# EAGLE schematic CFT-PB3-revB (EAGLE 5.11)
DRAWN_BY: Alexios; PROJECT_NAME: CFT Mini-Computer; REVISION: Rev B; SHEET_DESCRIPTION: 8 kW Bank Switching Memory Controller (with 74670); SIMULATION_FILENAME: memory.v#bank_switch; URL: http://www.bedroomlan.org/cft

## Sheet 1 of 7
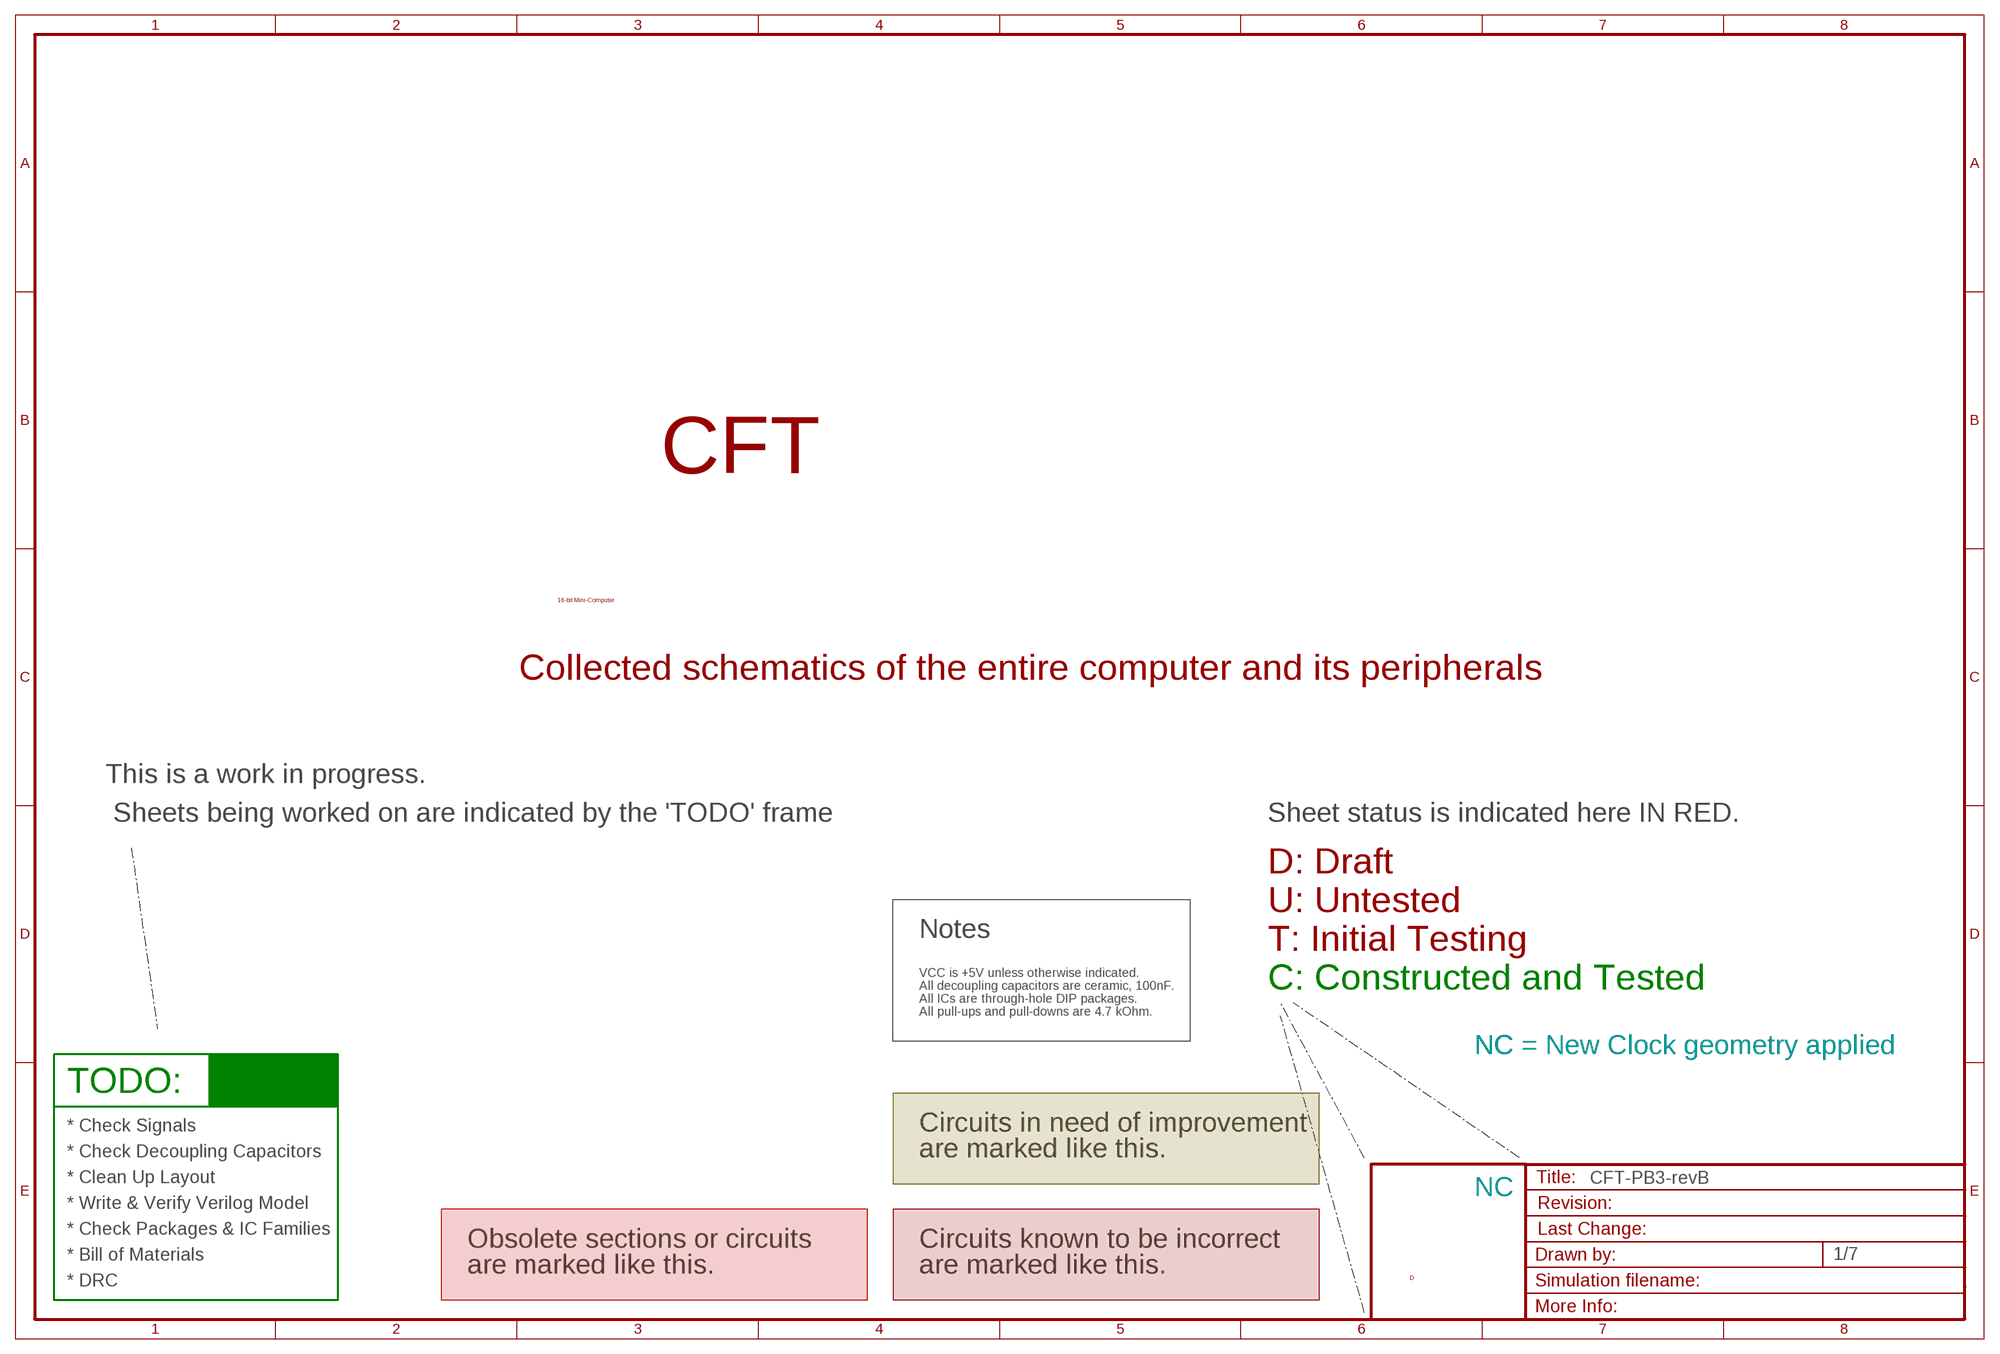
[diagram p0: schematic, sheet 1]

### Notes on the sheet
- CFT
- 16-bit Mini-Computer
- Collected schematics of the entire computer and its peripherals
- This is a work in progress.
- Sheets being worked on are indicated by the 'TODO' frame | Sheet status is indicated here IN RED.
- D: Draft
- U: Untested
- Notes
- T: Initial Testing
- VCC is +5V unless otherwise indicated.
- All decoupling capacitors are ceramic, 100nF. | C: Constructed and Tested
- All ICs are through-hole DIP packages.
- All pull-ups and pull-downs are 4.7 kOhm.
- NC | NC = New Clock geometry applied
- TODO:
- * Check Signals | Circuits in need of improvement
- * Check Decoupling Capacitors | are marked like this.
- * Clean Up Layout
- NC
- * Write & Verify Verilog Model
- * Check Packages & IC Families
- Obsolete sections or circuits | Circuits known to be incorrect
- * Bill of Materials
- are marked like this. | are marked like this.
- D
- * DRC

## Sheet 2 of 7
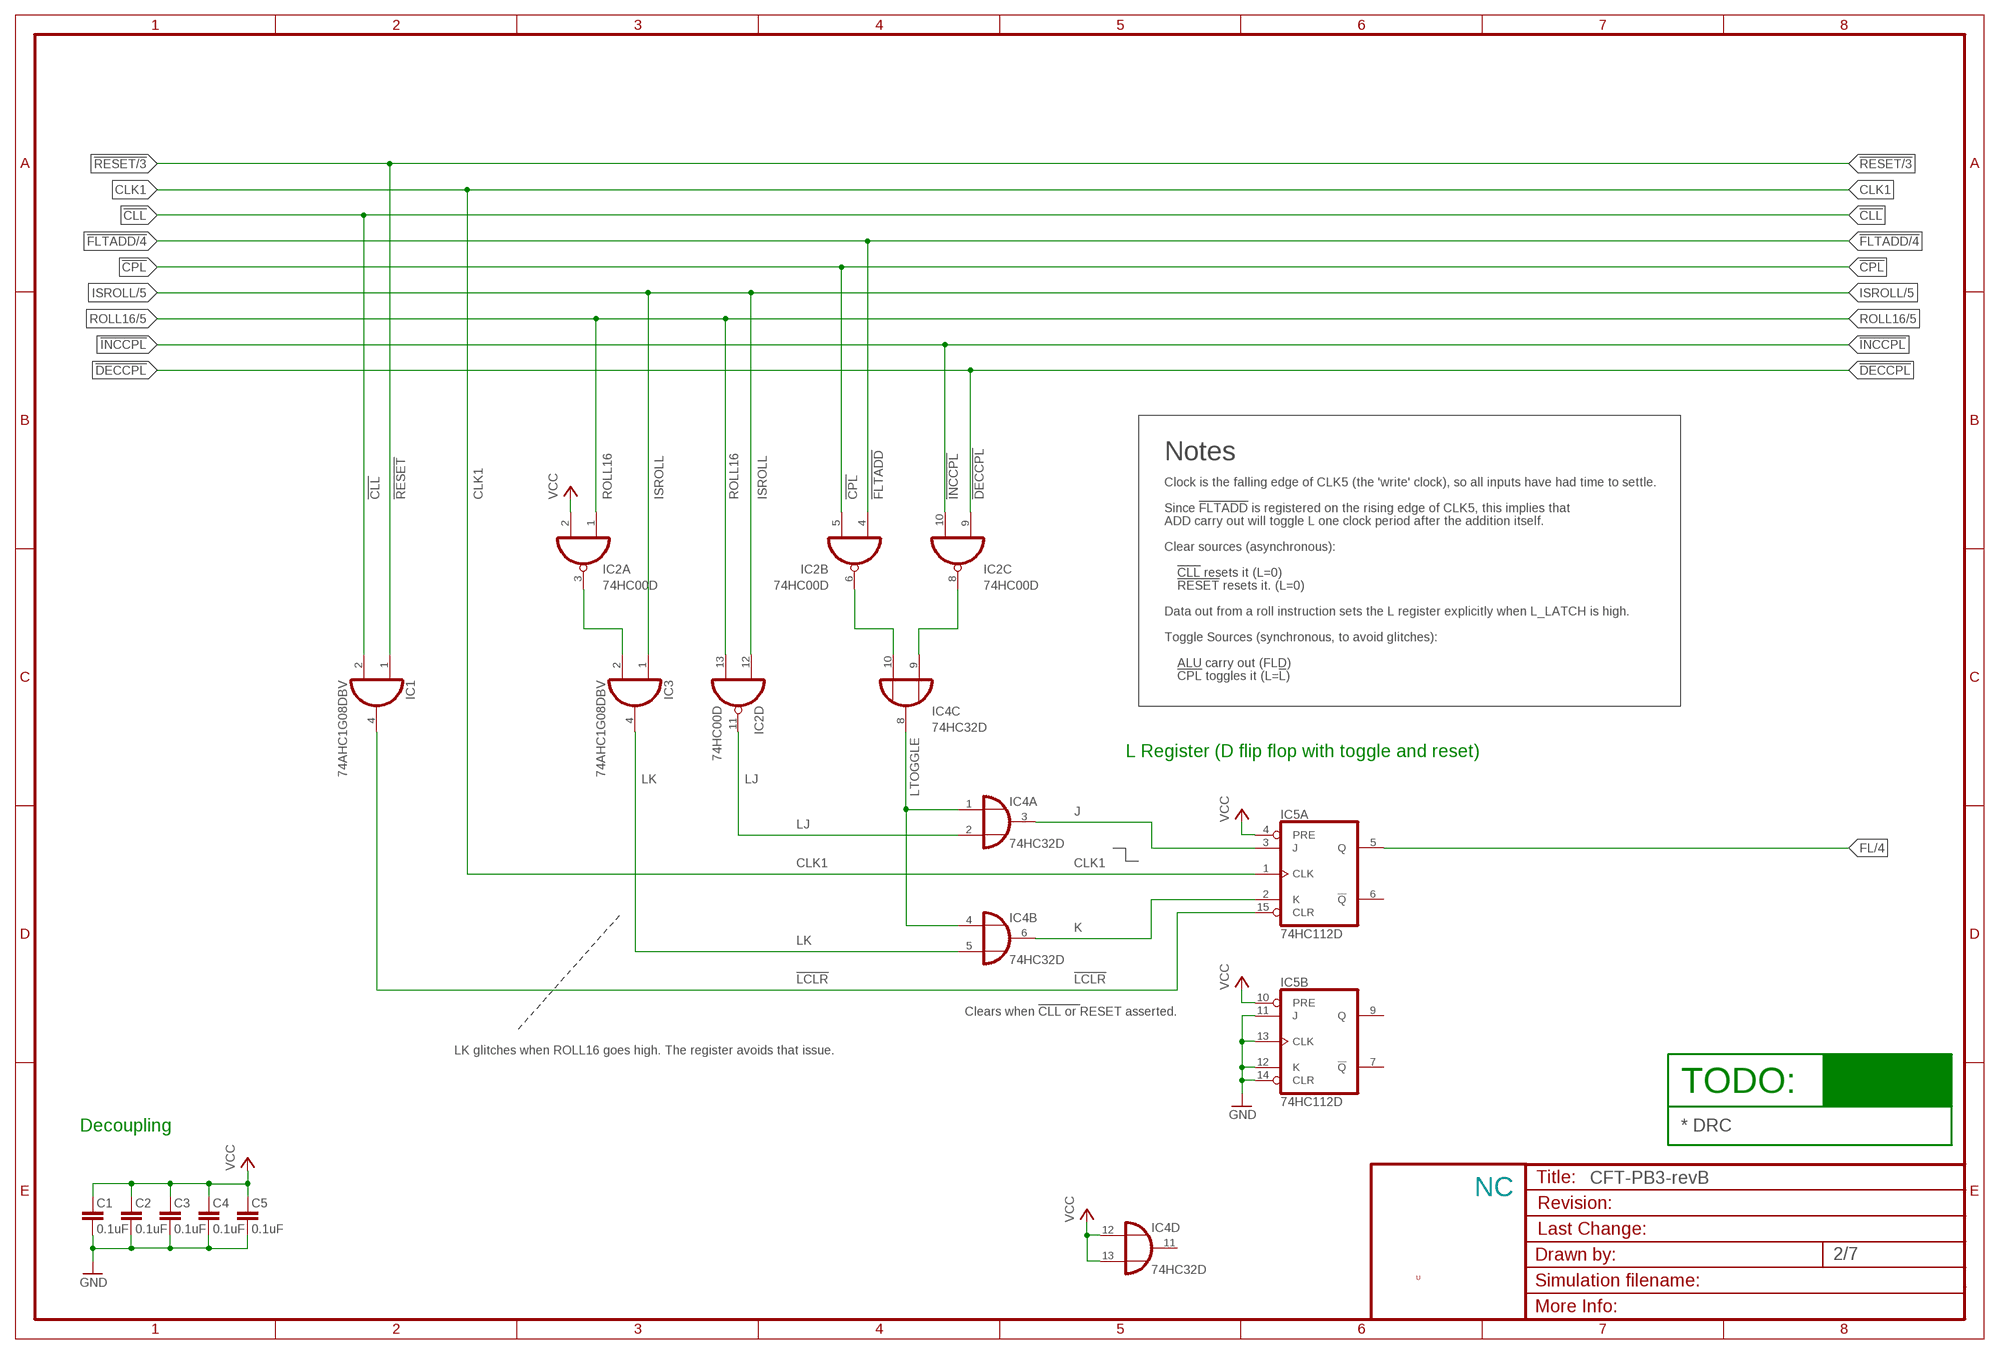
[diagram p1: schematic, sheet 2]

### Parts
C1  0.1uF  C-EUC0805K  [C0805K]
C2  0.1uF  C-EUC0805K  [C0805K]
C3  0.1uF  C-EUC0805K  [C0805K]
C4  0.1uF  C-EUC0805K  [C0805K]
C5  0.1uF  C-EUC0805K  [C0805K]
IC1  74AHC1G08DBV  [SOT23-5]
IC2  74HC00D  [SO14]
IC3  74AHC1G08DBV  [SOT23-5]
IC4  74HC32D  [SO14]
IC5  74HC112D  [SO16]

### Nets
!CLL: IC1.2(I1) ; also sheet 7
!CPL: IC2.5(B:I1) ; also sheet 7
!DECCPL: IC2.9(C:I0) ; also sheet 7
!FLTADD: IC2.4(B:I0) ; also sheet 4
!INCCPL: IC2.10(C:I1) ; also sheet 7
!LCLR: IC1.4(O) IC5.15(A:CLR)
!RESET: IC1.1(I0) ; also sheet 3,4,5,6,7
CLK1: IC5.1(A:CLK) ; also sheet 7
FL: IC5.5(A:Q) ; also sheet 4,5,7
GND [low power]: C1.1 C2.1 C3.1 C4.1 C5.1 IC5.11(B:J) IC5.12(B:K) IC5.13(B:CLK) IC5.14(B:CLR) ; also sheet 3,4,5,6,7
ISROLL: IC2.12(D:I0) IC3.1(I0) ; also sheet 5
J: IC4.3(A:O) IC5.3(A:J)
K: IC4.6(B:O) IC5.2(A:K)
LJ: IC2.11(D:O) IC4.2(A:I1)
LK: IC3.4(O) IC4.5(B:I1)
LTOGGLE: IC4.1(A:I0) IC4.4(B:I0) IC4.8(C:O)
LTOGGLE0: IC2.6(B:O) IC4.10(C:I1)
LTOGGLE1: IC2.8(C:O) IC4.9(C:I0)
N$98: IC2.3(A:O) IC3.2(I1)
ROLL16: IC2.1(A:I0) IC2.13(D:I1) ; also sheet 5
VCC [low power]: C1.2 C2.2 C3.2 C4.2 C5.2 IC2.2(A:I1) IC4.12(D:I0) IC4.13(D:I1) IC5.4(A:PRE) IC5.10(B:PRE) ; also sheet 3,4,5,6,7
Unconnected: IC4.11(D:O) IC5.6(A:!Q) IC5.7(B:!Q) IC5.9(B:Q)

### Notes on the sheet
- Notes
- Clock is the falling edge of CLK5 (the 'write' clock), so all inputs have had time to settle.
- Since !FLTADD! is registered on the rising edge of CLK5, this implies that
- ADD carry out will toggle L one clock period after the addition itself.
- Clear sources (asynchronous):
- !CLL! resets it (L=0)
- !RESET! resets it. (L=0)
- Data out from a roll instruction sets the L register explicitly when L_LATCH is high.
- Toggle Sources (synchronous, to avoid glitches):
- ALU carry out (FLD)
- !CPL! toggles it (L=!L!)
- L Register (D flip flop with toggle and reset)
- Clears when !CLL or !RESET asserted.
- LK glitches when ROLL16 goes high. The register avoids that issue.
- TODO:
- Decoupling | * DRC
- NC
- U

## Sheet 3 of 7
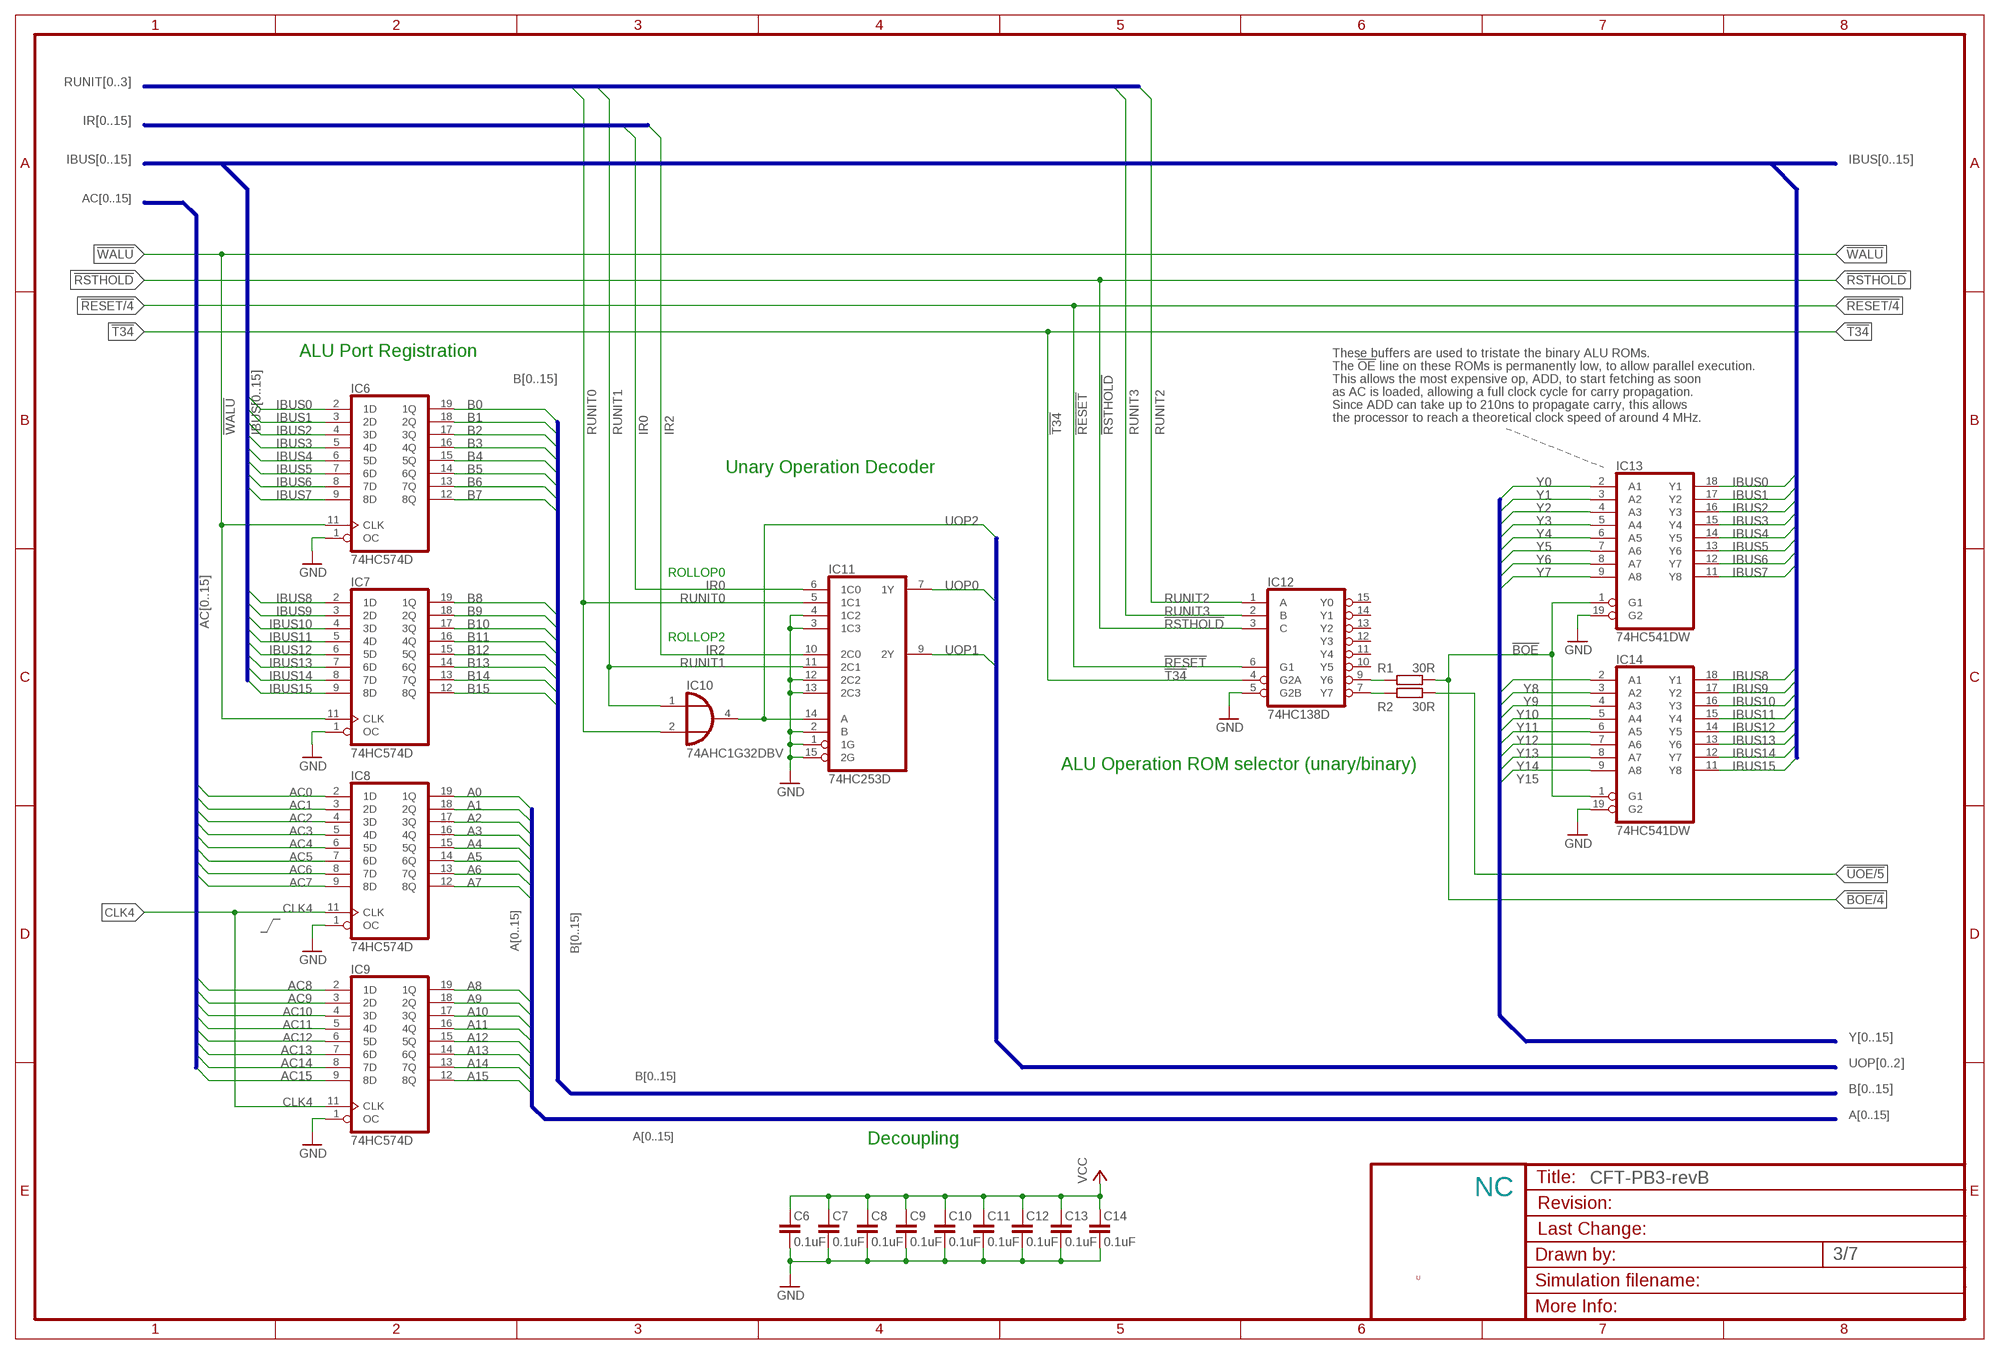
[diagram p2: schematic, sheet 3]

### Parts
C6  0.1uF  C-EUC0805K  [C0805K]
C7  0.1uF  C-EUC0805K  [C0805K]
C8  0.1uF  C-EUC0805K  [C0805K]
C9  0.1uF  C-EUC0805K  [C0805K]
C10  0.1uF  C-EUC0805K  [C0805K]
C11  0.1uF  C-EUC0805K  [C0805K]
C12  0.1uF  C-EUC0805K  [C0805K]
C13  0.1uF  C-EUC0805K  [C0805K]
C14  0.1uF  C-EUC0805K  [C0805K]
IC6  74HC574D  [SO20W]
IC7  74HC574D  [SO20W]
IC8  74HC574D  [SO20W]
IC9  74HC574D  [SO20W]
IC10  74AHC1G32DBV  [SOT23-5]
IC11  74HC253D  [SO16]
IC12  74HC138D  [SO16]
IC13  74HC541DW  [SO20W]
IC14  74HC541DW  [SO20W]
R1  30R  R-EU_R0805  [R0805]
R2  30R  R-EU_R0805  [R0805]

### Nets
!BOE: IC13.1(G1) IC14.1(G1) R1.2 ; also sheet 4
!RESET: IC12.6(G1) ; also sheet 2,4,5,6,7
!RSTHOLD: IC12.3(C) ; also sheet 7
!T34: IC12.4(G2A) ; also sheet 7
!UOE: R2.2 ; also sheet 5
!WALU: IC6.11(CLK) IC7.11(CLK) ; also sheet 7
A0: IC8.19(1Q) ; also sheet 4,5
A1: IC8.18(2Q) ; also sheet 4,5
A2: IC8.17(3Q) ; also sheet 4,5
A3: IC8.16(4Q) ; also sheet 4,5
A4: IC8.15(5Q) ; also sheet 4,5
A5: IC8.14(6Q) ; also sheet 4,5
A6: IC8.13(7Q) ; also sheet 4,5
A7: IC8.12(8Q) ; also sheet 4,5
A8: IC9.19(1Q) ; also sheet 4,5
A9: IC9.18(2Q) ; also sheet 4,5
A10: IC9.17(3Q) ; also sheet 4,5
A11: IC9.16(4Q) ; also sheet 4,5
A12: IC9.15(5Q) ; also sheet 4,5
A13: IC9.14(6Q) ; also sheet 4,5
A14: IC9.13(7Q) ; also sheet 4,5
A15: IC9.12(8Q) ; also sheet 4,5
AC0: IC8.2(1D) ; also sheet 7
AC1: IC8.3(2D) ; also sheet 7
AC2: IC8.4(3D) ; also sheet 7
AC3: IC8.5(4D) ; also sheet 7
AC4: IC8.6(5D) ; also sheet 7
AC5: IC8.7(6D) ; also sheet 7
AC6: IC8.8(7D) ; also sheet 7
AC7: IC8.9(8D) ; also sheet 7
AC8: IC9.2(1D) ; also sheet 7
AC9: IC9.3(2D) ; also sheet 7
AC10: IC9.4(3D) ; also sheet 7
AC11: IC9.5(4D) ; also sheet 7
AC12: IC9.6(5D) ; also sheet 7
AC13: IC9.7(6D) ; also sheet 7
AC14: IC9.8(7D) ; also sheet 7
AC15: IC9.9(8D) ; also sheet 7
B0: IC6.19(1Q) ; also sheet 4
B1: IC6.18(2Q) ; also sheet 4
B2: IC6.17(3Q) ; also sheet 4
B3: IC6.16(4Q) ; also sheet 4
B4: IC6.15(5Q) ; also sheet 4
B5: IC6.14(6Q) ; also sheet 4
B6: IC6.13(7Q) ; also sheet 4
B7: IC6.12(8Q) ; also sheet 4
B8: IC7.19(1Q) ; also sheet 4
B9: IC7.18(2Q) ; also sheet 4
B10: IC7.17(3Q) ; also sheet 4
B11: IC7.16(4Q) ; also sheet 4
B12: IC7.15(5Q) ; also sheet 4
B13: IC7.14(6Q) ; also sheet 4
B14: IC7.13(7Q) ; also sheet 4
B15: IC7.12(8Q) ; also sheet 4
CLK4: IC8.11(CLK) IC9.11(CLK) ; also sheet 7
GND [low power]: C6.1 C7.1 C8.1 C9.1 C10.1 C11.1 C12.1 C13.1 C14.1 IC6.1(OC) IC7.1(OC) IC8.1(OC) IC9.1(OC) IC11.1(1G) IC11.2(B) IC11.3(1C3) IC11.4(1C2) IC11.12(2C2) IC11.13(2C3) IC11.15(2G) IC12.5(G2B) IC13.19(G2) IC14.19(G2) ; also sheet 2,4,5,6,7
IBUS0: IC6.2(1D) IC13.18(Y1) ; also sheet 5,7
IBUS1: IC6.3(2D) IC13.17(Y2) ; also sheet 5,7
IBUS2: IC6.4(3D) IC13.16(Y3) ; also sheet 5,7
IBUS3: IC6.5(4D) IC13.15(Y4) ; also sheet 5,7
IBUS4: IC6.6(5D) IC13.14(Y5) ; also sheet 5,7
IBUS5: IC6.7(6D) IC13.13(Y6) ; also sheet 5,7
IBUS6: IC6.8(7D) IC13.12(Y7) ; also sheet 5,7
IBUS7: IC6.9(8D) IC13.11(Y8) ; also sheet 5,7
IBUS8: IC7.2(1D) IC14.18(Y1) ; also sheet 5,7
IBUS9: IC7.3(2D) IC14.17(Y2) ; also sheet 5,7
IBUS10: IC7.4(3D) IC14.16(Y3) ; also sheet 5,7
IBUS11: IC7.5(4D) IC14.15(Y4) ; also sheet 5,7
IBUS12: IC7.6(5D) IC14.14(Y5) ; also sheet 5,7
IBUS13: IC7.7(6D) IC14.13(Y6) ; also sheet 5,7
IBUS14: IC7.8(7D) IC14.12(Y7) ; also sheet 5,7
IBUS15: IC7.9(8D) IC14.11(Y8) ; also sheet 5,7
IR0: IC11.6(1C0) ; also sheet 7
IR2: IC11.10(2C0) ; also sheet 7
N$1: IC12.9(Y6) R1.1
N$2: IC12.7(Y7) R2.1
RUNIT0: IC10.2(I1) IC11.5(1C1) ; also sheet 4,7
RUNIT1: IC10.1(I0) IC11.11(2C1) ; also sheet 4,7
RUNIT2: IC12.1(A) ; also sheet 7
RUNIT3: IC12.2(B) ; also sheet 7
UOP0: IC11.7(1Y) ; also sheet 5
UOP1: IC11.9(2Y) ; also sheet 5
UOP2: IC10.4(O) IC11.14(A) ; also sheet 5
VCC [low power]: C6.2 C7.2 C8.2 C9.2 C10.2 C11.2 C12.2 C13.2 C14.2 ; also sheet 2,4,5,6,7
Y0: IC13.2(A1) ; also sheet 4
Y1: IC13.3(A2) ; also sheet 4
Y2: IC13.4(A3) ; also sheet 4
Y3: IC13.5(A4) ; also sheet 4
Y4: IC13.6(A5) ; also sheet 4
Y5: IC13.7(A6) ; also sheet 4
Y6: IC13.8(A7) ; also sheet 4
Y7: IC13.9(A8) ; also sheet 4
Y8: IC14.2(A1) ; also sheet 4
Y9: IC14.3(A2) ; also sheet 4
Y10: IC14.4(A3) ; also sheet 4
Y11: IC14.5(A4) ; also sheet 4
Y12: IC14.6(A5) ; also sheet 4
Y13: IC14.7(A6) ; also sheet 4
Y14: IC14.8(A7) ; also sheet 4
Y15: IC14.9(A8) ; also sheet 4
Unconnected: IC12.10(Y5) IC12.11(Y4) IC12.12(Y3) IC12.13(Y2) IC12.14(Y1) IC12.15(Y0)

### Buses
IBUS[0..15]
B[0..15]
UOP[0..2]
IR[0..15]
RUNIT[0..3]
Y[0..15]
AC[0..15]
A[0..15]

### Notes on the sheet
- ALU Port Registration | These buffers are used to tristate the binary ALU ROMs.
- The !OE! line on these ROMs is permanently low, to allow parallel execution.
- This allows the most expensive op, ADD, to start fetching as soon
- as AC is loaded, allowing a full clock cycle for carry propagation.
- Since ADD can take up to 210ns to propagate carry, this allows
- the processor to reach a theoretical clock speed of around 4 MHz.
- Unary Operation Decoder
- ROLLOP0
- ROLLOP2
- ALU Operation ROM selector (unary/binary)
- Decoupling
- NC
- U

## Sheet 4 of 7
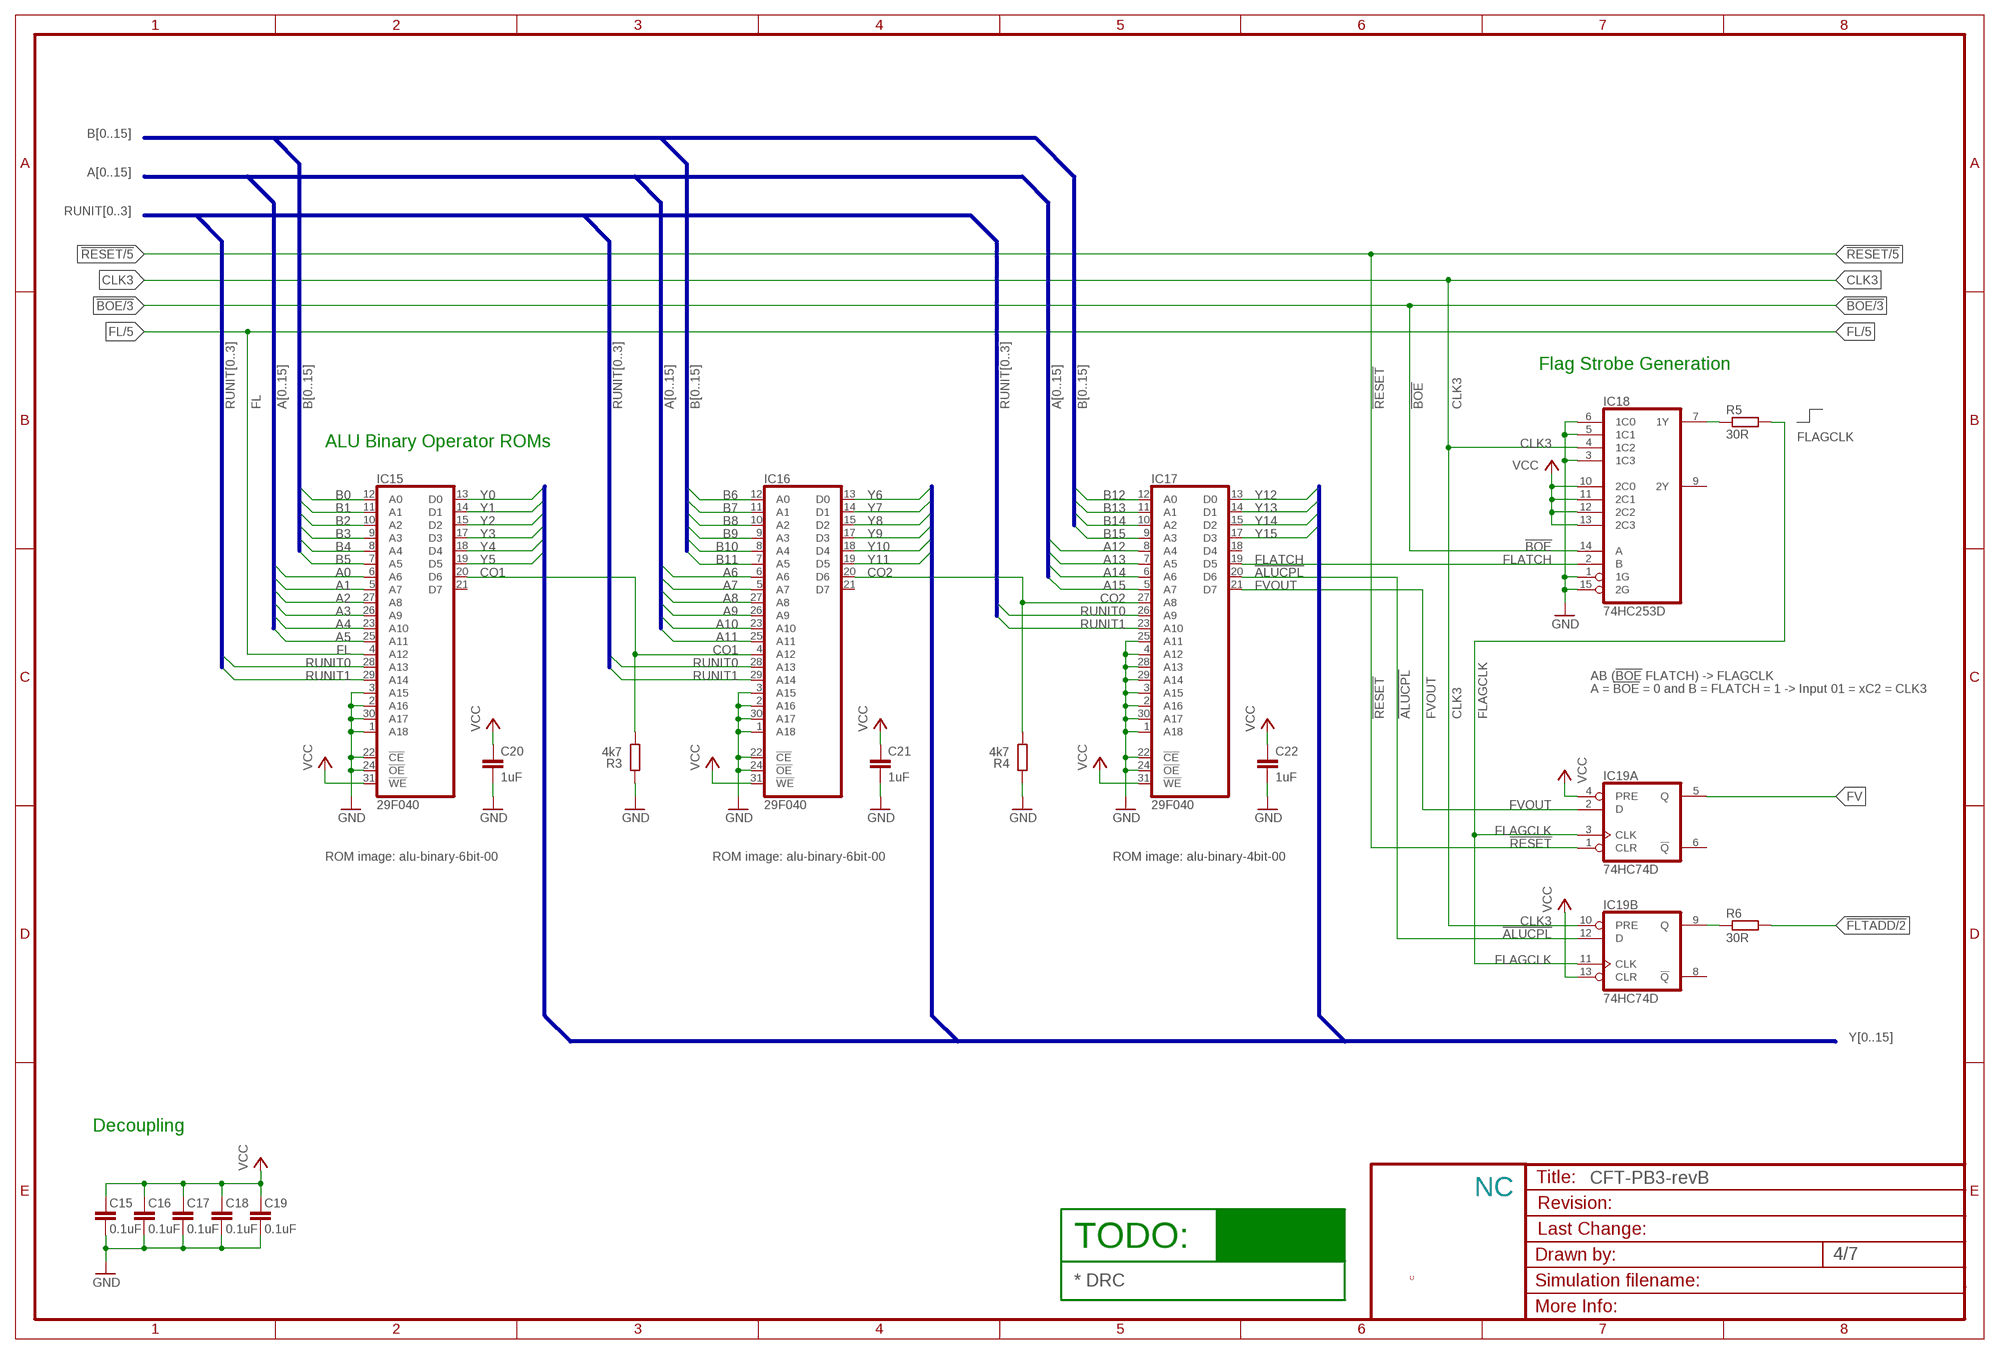
[diagram p3: schematic, sheet 4]

### Parts
C15  0.1uF  C-EUC0805K  [C0805K]
C16  0.1uF  C-EUC0805K  [C0805K]
C17  0.1uF  C-EUC0805K  [C0805K]
C18  0.1uF  C-EUC0805K  [C0805K]
C19  0.1uF  C-EUC0805K  [C0805K]
C20  1uF  C-EUC1206K  [C1206K]
C21  1uF  C-EUC1206K  [C1206K]
C22  1uF  C-EUC1206K  [C1206K]
IC15  29F040  29F040PLCC32  [PLCC32]
IC16  29F040  29F040PLCC32  [PLCC32]
IC17  29F040  29F040PLCC32  [PLCC32]
IC18  74HC253D  [SO16]
IC19  74HC74D  [SO14]
R3  4k7  R-EU_R0805  [R0805]
R4  4k7  R-EU_R0805  [R0805]
R5  30R  R-EU_R0805  [R0805]
R6  30R  R-EU_R0805  [R0805]

### Nets
!ALUCPL: IC17.20(D6) IC19.12(B:D)
!BOE: IC18.14(A) ; also sheet 3
!FLTADD: R6.2 ; also sheet 2
!RESET: IC19.1(A:CLR) ; also sheet 2,3,5,6,7
A0: IC15.6(A6) ; also sheet 3,5
A1: IC15.5(A7) ; also sheet 3,5
A2: IC15.27(A8) ; also sheet 3,5
A3: IC15.26(A9) ; also sheet 3,5
A4: IC15.23(A10) ; also sheet 3,5
A5: IC15.25(A11) ; also sheet 3,5
A6: IC16.6(A6) ; also sheet 3,5
A7: IC16.5(A7) ; also sheet 3,5
A8: IC16.27(A8) ; also sheet 3,5
A9: IC16.26(A9) ; also sheet 3,5
A10: IC16.23(A10) ; also sheet 3,5
A11: IC16.25(A11) ; also sheet 3,5
A12: IC17.8(A4) ; also sheet 3,5
A13: IC17.7(A5) ; also sheet 3,5
A14: IC17.6(A6) ; also sheet 3,5
A15: IC17.5(A7) ; also sheet 3,5
B0: IC15.12(A0) ; also sheet 3
B1: IC15.11(A1) ; also sheet 3
B2: IC15.10(A2) ; also sheet 3
B3: IC15.9(A3) ; also sheet 3
B4: IC15.8(A4) ; also sheet 3
B5: IC15.7(A5) ; also sheet 3
B6: IC16.12(A0) ; also sheet 3
B7: IC16.11(A1) ; also sheet 3
B8: IC16.10(A2) ; also sheet 3
B9: IC16.9(A3) ; also sheet 3
B10: IC16.8(A4) ; also sheet 3
B11: IC16.7(A5) ; also sheet 3
B12: IC17.12(A0) ; also sheet 3
B13: IC17.11(A1) ; also sheet 3
B14: IC17.10(A2) ; also sheet 3
B15: IC17.9(A3) ; also sheet 3
CLK3: IC18.4(1C2) IC19.10(B:PRE) ; also sheet 7
CO1: IC15.20(D6) IC16.4(A12) R3.1
CO2: IC16.20(D6) IC17.27(A8) R4.1
FL: IC15.4(A12) ; also sheet 2,5,7
FLAGCLK: IC19.3(A:CLK) IC19.11(B:CLK) R5.2
FLATCH: IC17.19(D5) IC18.2(B)
FV: IC19.5(A:Q) ; also sheet 7
FVOUT: IC17.21(D7) IC19.2(A:D)
GND [low power]: C15.1 C16.1 C17.1 C18.1 C19.1 C20.2 C21.2 C22.2 IC15.1(A18) IC15.2(A16) IC15.3(A15) IC15.22(!CE) IC15.24(!OE) IC15.30(A17) IC16.1(A18) IC16.2(A16) IC16.3(A15) IC16.22(!CE) IC16.24(!OE) IC16.30(A17) IC17.1(A18) IC17.2(A16) IC17.3(A15) IC17.4(A12) IC17.22(!CE) IC17.24(!OE) IC17.25(A11) IC17.28(A13) IC17.29(A14) IC17.30(A17) IC18.1(1G) IC18.3(1C3) IC18.5(1C1) IC18.6(1C0) IC18.15(2G) R3.2 R4.2 ; also sheet 2,3,5,6,7
N$3: IC18.7(1Y) R5.1
N$5: IC19.9(B:Q) R6.1
RUNIT0: IC15.28(A13) IC16.28(A13) IC17.26(A9) ; also sheet 3,7
RUNIT1: IC15.29(A14) IC16.29(A14) IC17.23(A10) ; also sheet 3,7
VCC [low power]: C15.2 C16.2 C17.2 C18.2 C19.2 C20.1 C21.1 C22.1 IC15.31(!WE) IC16.31(!WE) IC17.31(!WE) IC18.10(2C0) IC18.11(2C1) IC18.12(2C2) IC18.13(2C3) IC19.4(A:PRE) IC19.13(B:CLR) ; also sheet 2,3,5,6,7
Y0: IC15.13(D0) ; also sheet 3
Y1: IC15.14(D1) ; also sheet 3
Y2: IC15.15(D2) ; also sheet 3
Y3: IC15.17(D3) ; also sheet 3
Y4: IC15.18(D4) ; also sheet 3
Y5: IC15.19(D5) ; also sheet 3
Y6: IC16.13(D0) ; also sheet 3
Y7: IC16.14(D1) ; also sheet 3
Y8: IC16.15(D2) ; also sheet 3
Y9: IC16.17(D3) ; also sheet 3
Y10: IC16.18(D4) ; also sheet 3
Y11: IC16.19(D5) ; also sheet 3
Y12: IC17.13(D0) ; also sheet 3
Y13: IC17.14(D1) ; also sheet 3
Y14: IC17.15(D2) ; also sheet 3
Y15: IC17.17(D3) ; also sheet 3
Unconnected: IC15.21(D7) IC16.21(D7) IC17.18(D4) IC18.9(2Y) IC19.6(A:!Q) IC19.8(B:!Q)

### Buses
Y[0..15]
B[0..15]
RUNIT[0..3]
A[0..15]

### Notes on the sheet
- Flag Strobe Generation
- ALU Binary Operator ROMs
- AB (!BOE! FLATCH) -> FLAGCLK
- A = !BOE! = 0 and B = FLATCH = 1 -> Input 01 = xC2 = CLK3
- ROM image: alu-binary-6bit-00 | ROM image: alu-binary-6bit-00 | ROM image: alu-binary-4bit-00
- Decoupling
- NC
- TODO:
- U
- * DRC

## Sheet 5 of 7
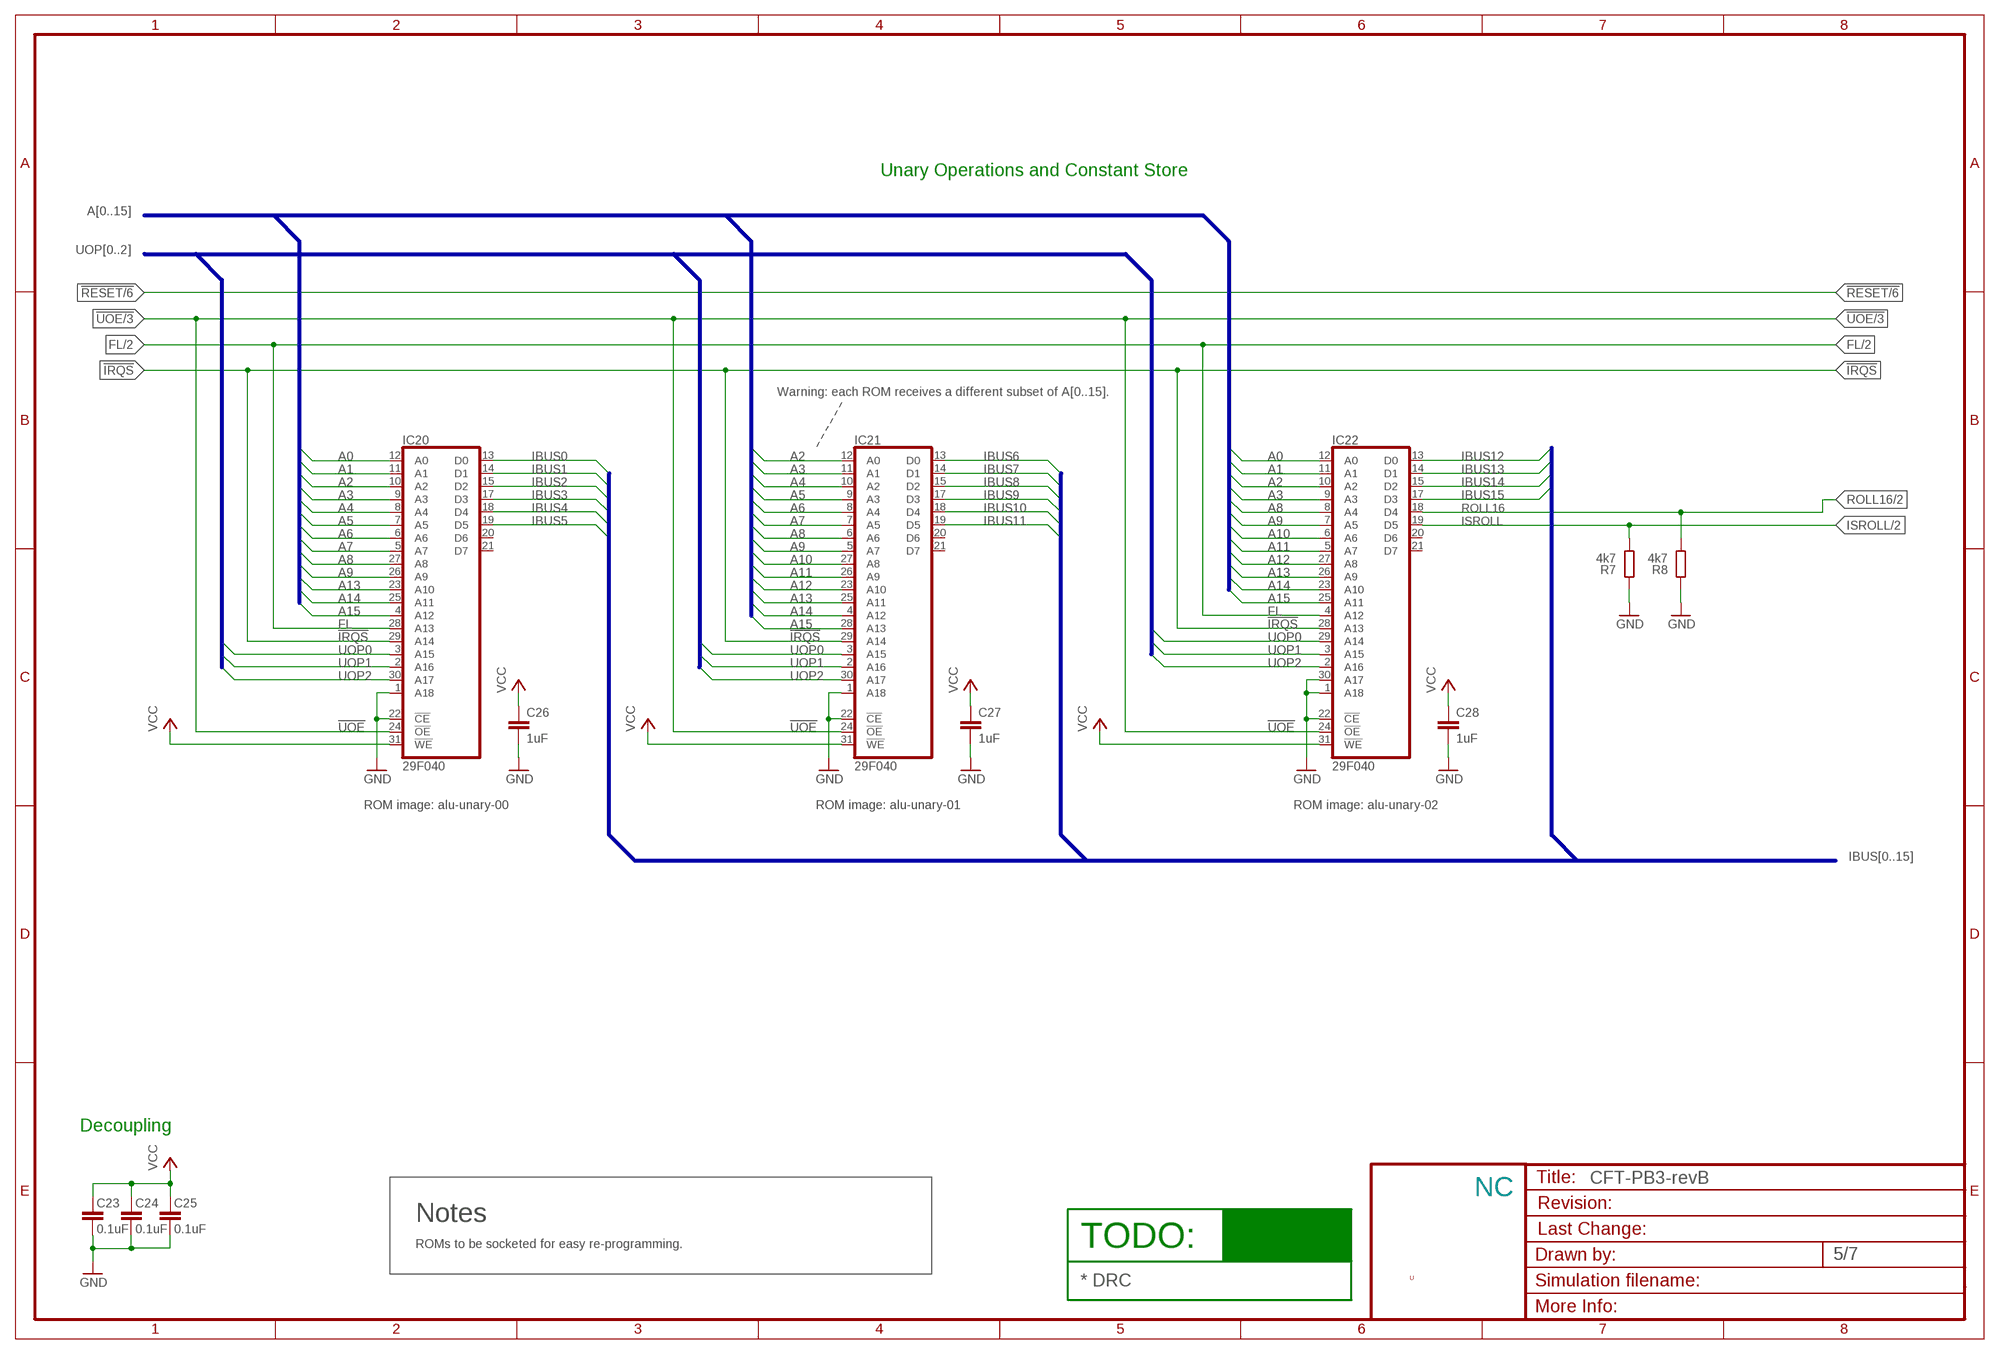
[diagram p4: schematic, sheet 5]

### Parts
C23  0.1uF  C-EUC0805K  [C0805K]
C24  0.1uF  C-EUC0805K  [C0805K]
C25  0.1uF  C-EUC0805K  [C0805K]
C26  1uF  C-EUC0805K  [C0805K]
C27  1uF  C-EUC0805K  [C0805K]
C28  1uF  C-EUC0805K  [C0805K]
IC20  29F040  29F040PLCC32  [PLCC32]
IC21  29F040  29F040PLCC32  [PLCC32]
IC22  29F040  29F040PLCC32  [PLCC32]
R7  4k7  R-EU_R0805  [R0805]
R8  4k7  R-EU_R0805  [R0805]

### Nets
!IRQS: IC20.29(A14) IC21.29(A14) IC22.28(A13) ; also sheet 7
!UOE: IC20.24(!OE) IC21.24(!OE) IC22.24(!OE) ; also sheet 3
A0: IC20.12(A0) IC22.12(A0) ; also sheet 3,4
A1: IC20.11(A1) IC22.11(A1) ; also sheet 3,4
A2: IC20.10(A2) IC21.12(A0) IC22.10(A2) ; also sheet 3,4
A3: IC20.9(A3) IC21.11(A1) IC22.9(A3) ; also sheet 3,4
A4: IC20.8(A4) IC21.10(A2) ; also sheet 3,4
A5: IC20.7(A5) IC21.9(A3) ; also sheet 3,4
A6: IC20.6(A6) IC21.8(A4) ; also sheet 3,4
A7: IC20.5(A7) IC21.7(A5) ; also sheet 3,4
A8: IC20.27(A8) IC21.6(A6) IC22.8(A4) ; also sheet 3,4
A9: IC20.26(A9) IC21.5(A7) IC22.7(A5) ; also sheet 3,4
A10: IC21.27(A8) IC22.6(A6) ; also sheet 3,4
A11: IC21.26(A9) IC22.5(A7) ; also sheet 3,4
A12: IC21.23(A10) IC22.27(A8) ; also sheet 3,4
A13: IC20.23(A10) IC21.25(A11) IC22.26(A9) ; also sheet 3,4
A14: IC20.25(A11) IC21.4(A12) IC22.23(A10) ; also sheet 3,4
A15: IC20.4(A12) IC21.28(A13) IC22.25(A11) ; also sheet 3,4
FL: IC20.28(A13) IC22.4(A12) ; also sheet 2,4,7
GND [low power]: C23.1 C24.1 C25.1 C26.2 C27.2 C28.2 IC20.1(A18) IC20.22(!CE) IC21.1(A18) IC21.22(!CE) IC22.1(A18) IC22.22(!CE) IC22.30(A17) R7.2 R8.2 ; also sheet 2,3,4,6,7
IBUS0: IC20.13(D0) ; also sheet 3,7
IBUS1: IC20.14(D1) ; also sheet 3,7
IBUS2: IC20.15(D2) ; also sheet 3,7
IBUS3: IC20.17(D3) ; also sheet 3,7
IBUS4: IC20.18(D4) ; also sheet 3,7
IBUS5: IC20.19(D5) ; also sheet 3,7
IBUS6: IC21.13(D0) ; also sheet 3,7
IBUS7: IC21.14(D1) ; also sheet 3,7
IBUS8: IC21.15(D2) ; also sheet 3,7
IBUS9: IC21.17(D3) ; also sheet 3,7
IBUS10: IC21.18(D4) ; also sheet 3,7
IBUS11: IC21.19(D5) ; also sheet 3,7
IBUS12: IC22.13(D0) ; also sheet 3,7
IBUS13: IC22.14(D1) ; also sheet 3,7
IBUS14: IC22.15(D2) ; also sheet 3,7
IBUS15: IC22.17(D3) ; also sheet 3,7
ISROLL: IC22.19(D5) R7.1 ; also sheet 2
ROLL16: IC22.18(D4) R8.1 ; also sheet 2
UOP0: IC20.3(A15) IC21.3(A15) IC22.29(A14) ; also sheet 3
UOP1: IC20.2(A16) IC21.2(A16) IC22.3(A15) ; also sheet 3
UOP2: IC20.30(A17) IC21.30(A17) IC22.2(A16) ; also sheet 3
VCC [low power]: C23.2 C24.2 C25.2 C26.1 C27.1 C28.1 IC20.31(!WE) IC21.31(!WE) IC22.31(!WE) ; also sheet 2,3,4,6,7
Unconnected: IC20.20(D6) IC20.21(D7) IC21.20(D6) IC21.21(D7) IC22.20(D6) IC22.21(D7)

### Buses
A[0..15]
UOP[0..2]
IBUS[0..15]
RUNIT[0..3]

### Notes on the sheet
- Unary Operations and Constant Store
- Warning: each ROM receives a different subset of A[0..15].
- ROM image: alu-unary-00 | ROM image: alu-unary-01 | ROM image: alu-unary-02
- Decoupling
- NC
- Notes
- ROMs to be socketed for easy re-programming. | TODO:
- U
- * DRC

## Sheet 6 of 7
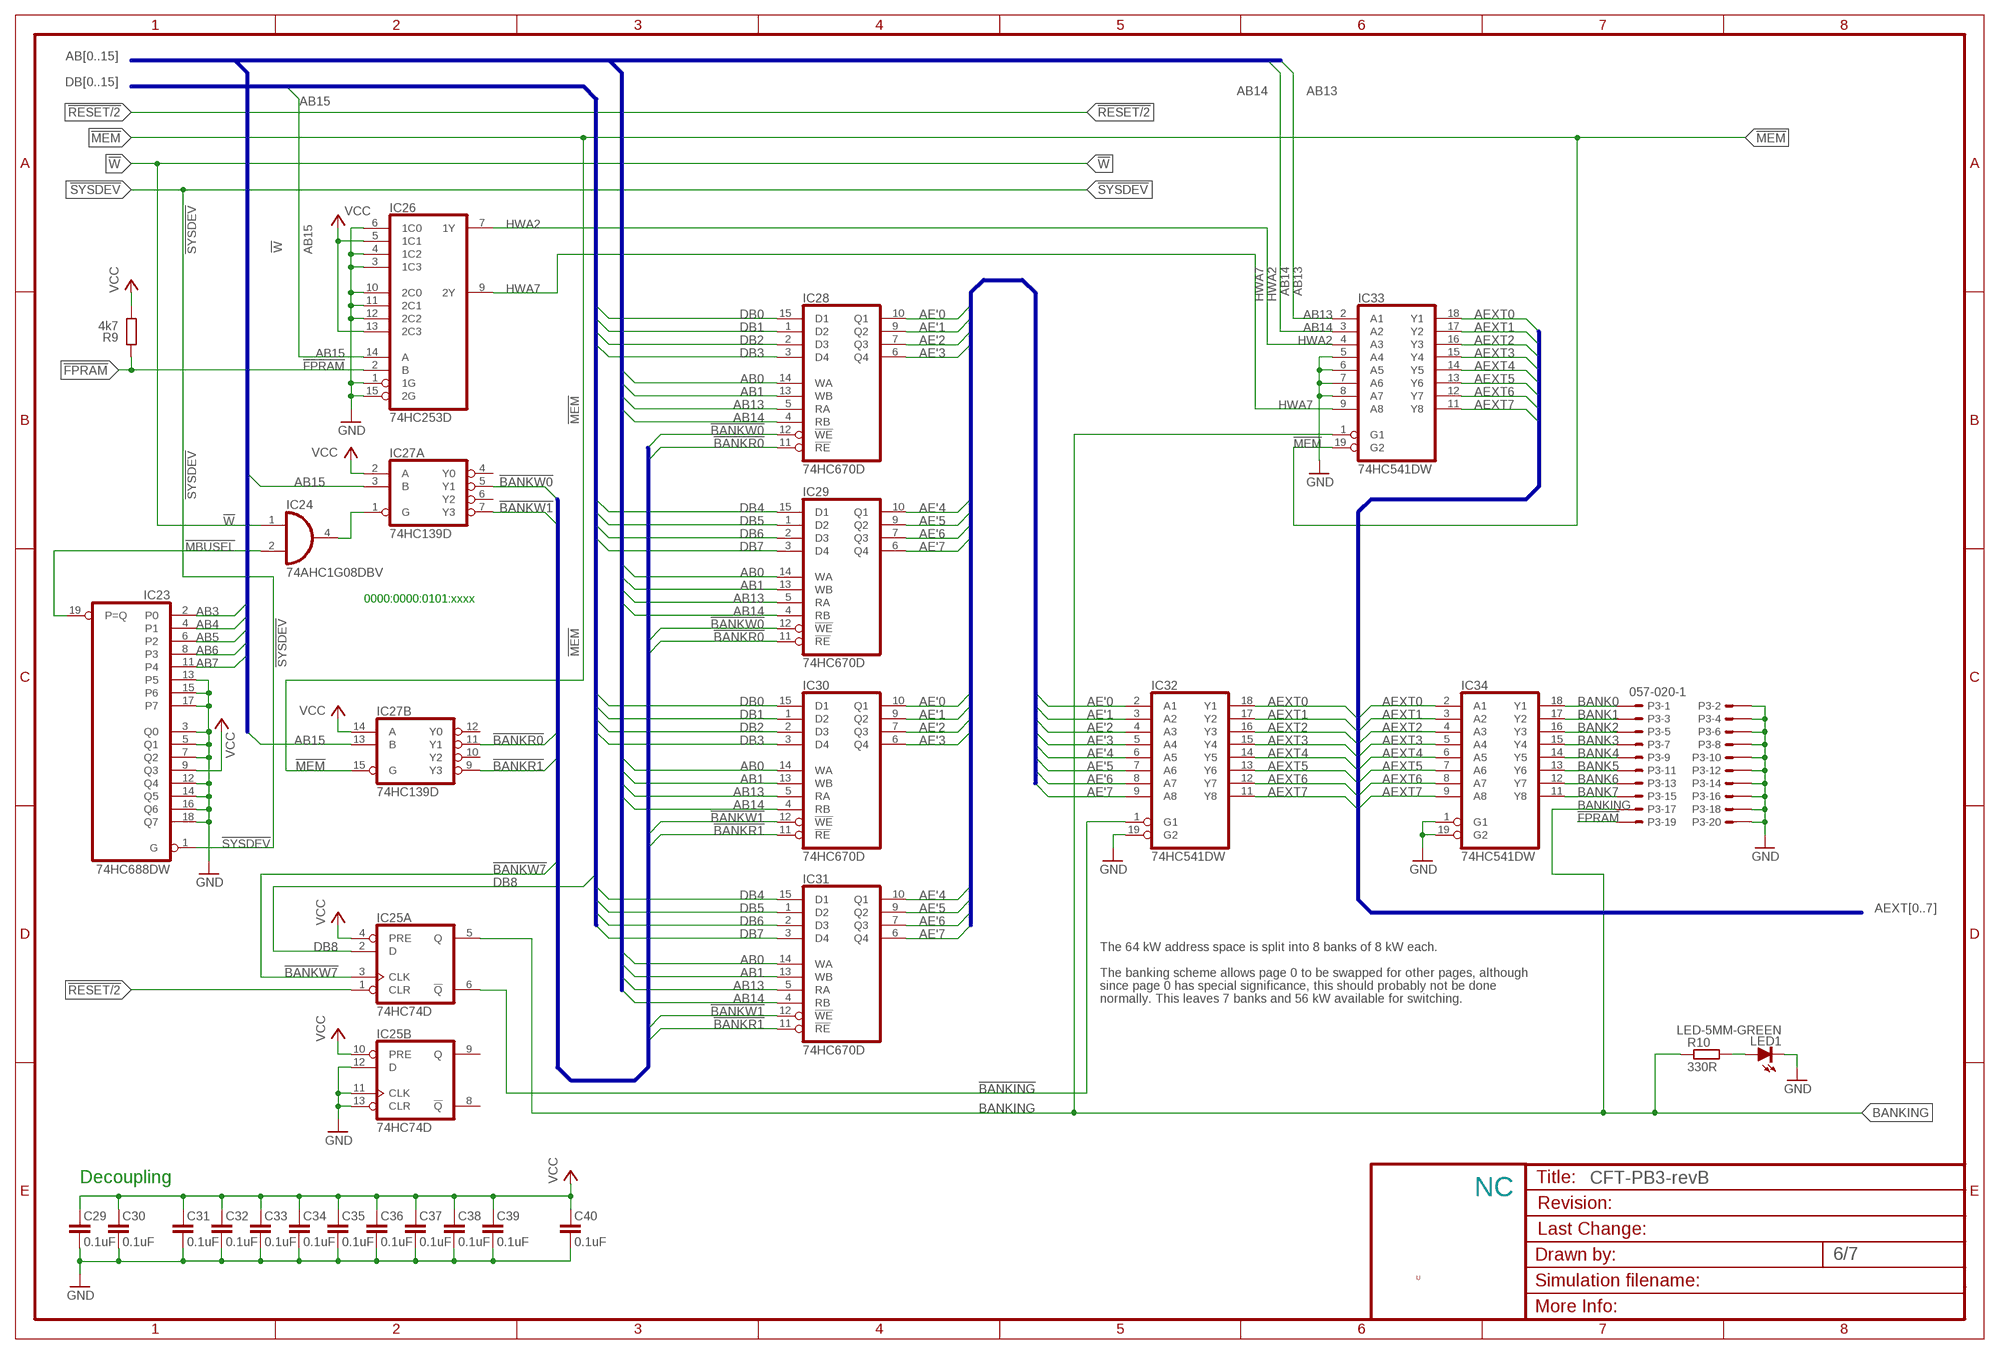
[diagram p5: schematic, sheet 6]

### Parts
C29  0.1uF  C-EUC0805K  [C0805K]
C30  0.1uF  C-EUC0805K  [C0805K]
C31  0.1uF  C-EUC0805K  [C0805K]
C32  0.1uF  C-EUC0805K  [C0805K]
C33  0.1uF  C-EUC0805K  [C0805K]
C34  0.1uF  C-EUC0805K  [C0805K]
C35  0.1uF  C-EUC0805K  [C0805K]
C36  0.1uF  C-EUC0805K  [C0805K]
C37  0.1uF  C-EUC0805K  [C0805K]
C38  0.1uF  C-EUC0805K  [C0805K]
C39  0.1uF  C-EUC0805K  [C0805K]
C40  0.1uF  C-EUC0805K  [C0805K]
IC23  74HC688DW  [SO20W]
IC24  74AHC1G08DBV  [SOT23-5]
IC25  74HC74D  [SO14]
IC26  74HC253D  [SO16]
IC27  74HC139D  [SO16]
IC28  74HC670D  [SO16]
IC29  74HC670D  [SO16]
IC30  74HC670D  [SO16]
IC31  74HC670D  [SO16]
IC32  74HC541DW  [SO20W]
IC33  74HC541DW  [SO20W]
IC34  74HC541DW  [SO20W]
LED1  LED-5MM-GREEN  LEDCHIPLED_0805  [CHIPLED_0805]
P3  057-020-1  [057-020-1]
R9  4k7  R-EU_R0805  [R0805]
R10  330R  R-EU_R0805  [R0805]

### Nets
!BANKING: IC25.6(A:!Q) IC32.1(G1)
!BANKR0: IC27.11(B:Y1) IC28.11(!RE) IC29.11(!RE)
!BANKR1: IC27.9(B:Y3) IC30.11(!RE) IC31.11(!RE)
!BANKW0: IC27.5(A:Y1) IC28.12(!WE) IC29.12(!WE)
!BANKW1: IC27.7(A:Y3) IC30.12(!WE) IC31.12(!WE)
!BANKW7: IC25.3(A:CLK)
!FPRAM: IC26.2(B) P3.19 R9.2
!MBUSEL: IC23.19(P=Q) IC24.2(I1)
!MEM: IC27.15(B:G) IC33.19(G2) ; also sheet 7
!RESET: IC25.1(A:CLR) ; also sheet 2,3,4,5,7
!SYSDEV: IC23.1(G) ; also sheet 7
!W: IC24.1(I0) ; also sheet 7
AB0: IC28.14(WA) IC29.14(WA) IC30.14(WA) IC31.14(WA) ; also sheet 7
AB1: IC28.13(WB) IC29.13(WB) IC30.13(WB) IC31.13(WB) ; also sheet 7
AB3: IC23.2(P0) ; also sheet 7
AB4: IC23.4(P1) ; also sheet 7
AB5: IC23.6(P2) ; also sheet 7
AB6: IC23.8(P3) ; also sheet 7
AB7: IC23.11(P4) ; also sheet 7
AB13: IC28.5(RA) IC29.5(RA) IC30.5(RA) IC31.5(RA) IC33.2(A1) ; also sheet 7
AB14: IC28.4(RB) IC29.4(RB) IC30.4(RB) IC31.4(RB) IC33.3(A2) ; also sheet 7
AB15: IC26.14(A) IC27.3(A:B) IC27.13(B:B) ; also sheet 7
AE'0: IC28.10(Q1) IC30.10(Q1) IC32.2(A1)
AE'1: IC28.9(Q2) IC30.9(Q2) IC32.3(A2)
AE'2: IC28.7(Q3) IC30.7(Q3) IC32.4(A3)
AE'3: IC28.6(Q4) IC30.6(Q4) IC32.5(A4)
AE'4: IC29.10(Q1) IC31.10(Q1) IC32.6(A5)
AE'5: IC29.9(Q2) IC31.9(Q2) IC32.7(A6)
AE'6: IC29.7(Q3) IC31.7(Q3) IC32.8(A7)
AE'7: IC29.6(Q4) IC31.6(Q4) IC32.9(A8)
AEXT0: IC32.18(Y1) IC33.18(Y1) IC34.2(A1) ; also sheet 7
AEXT1: IC32.17(Y2) IC33.17(Y2) IC34.3(A2) ; also sheet 7
AEXT2: IC32.16(Y3) IC33.16(Y3) IC34.4(A3) ; also sheet 7
AEXT3: IC32.15(Y4) IC33.15(Y4) IC34.5(A4) ; also sheet 7
AEXT4: IC32.14(Y5) IC33.14(Y5) IC34.6(A5) ; also sheet 7
AEXT5: IC32.13(Y6) IC33.13(Y6) IC34.7(A6) ; also sheet 7
AEXT6: IC32.12(Y7) IC33.12(Y7) IC34.8(A7) ; also sheet 7
AEXT7: IC32.11(Y8) IC33.11(Y8) IC34.9(A8) ; also sheet 7
BANK0: IC34.18(Y1) P3.1
BANK1: IC34.17(Y2) P3.3
BANK2: IC34.16(Y3) P3.5
BANK3: IC34.15(Y4) P3.7
BANK4: IC34.14(Y5) P3.9
BANK5: IC34.13(Y6) P3.11
BANK6: IC34.12(Y7) P3.13
BANK7: IC34.11(Y8) P3.15
BANKING: IC25.5(A:Q) IC33.1(G1) P3.17 R10.1
DB0: IC28.15(D1) IC30.15(D1) ; also sheet 7
DB1: IC28.1(D2) IC30.1(D2) ; also sheet 7
DB2: IC28.2(D3) IC30.2(D3) ; also sheet 7
DB3: IC28.3(D4) IC30.3(D4) ; also sheet 7
DB4: IC29.15(D1) IC31.15(D1) ; also sheet 7
DB5: IC29.1(D2) IC31.1(D2) ; also sheet 7
DB6: IC29.2(D3) IC31.2(D3) ; also sheet 7
DB7: IC29.3(D4) IC31.3(D4) ; also sheet 7
DB8: IC25.2(A:D) ; also sheet 7
GND [low power]: C29.1 C30.1 C31.1 C32.1 C33.1 C34.1 C35.1 C36.1 C37.1 C38.1 C39.1 C40.1 IC23.3(Q0) IC23.5(Q1) IC23.7(Q2) IC23.12(Q4) IC23.13(P5) IC23.14(Q5) IC23.15(P6) IC23.16(Q6) IC23.17(P7) IC23.18(Q7) IC25.11(B:CLK) IC25.12(B:D) IC25.13(B:CLR) IC26.1(1G) IC26.3(1C3) IC26.4(1C2) IC26.6(1C0) IC26.10(2C0) IC26.11(2C1) IC26.12(2C2) IC26.15(2G) IC32.19(G2) IC33.5(A4) IC33.6(A5) IC33.7(A6) IC33.8(A7) IC34.1(G1) IC34.19(G2) LED1.C P3.2 P3.4 P3.6 P3.8 P3.10 P3.12 P3.14 P3.16 P3.18 P3.20 ; also sheet 2,3,4,5,7
HWA2: IC26.7(1Y) IC33.4(A3)
HWA7: IC26.9(2Y) IC33.9(A8)
N$4: IC24.4(O) IC27.1(A:G)
N$341: LED1.A R10.2
VCC [low power]: C29.2 C30.2 C31.2 C32.2 C33.2 C34.2 C35.2 C36.2 C37.2 C38.2 C39.2 C40.2 IC23.9(Q3) IC25.4(A:PRE) IC25.10(B:PRE) IC26.5(1C1) IC26.13(2C3) IC27.2(A:A) IC27.14(B:A) R9.1 ; also sheet 2,3,4,5,7
Unconnected: IC25.8(B:!Q) IC25.9(B:Q) IC27.4(A:Y0) IC27.6(A:Y2) IC27.10(B:Y2) IC27.12(B:Y0)

### Buses
AB[0..15]
DB[0..15]
AE'[0..7]
AEXT[0..7]
!BANKW[0..1],!BANKR[0..1],!BANKEN

### Notes on the sheet
- 0000:0000:0101:xxxx
- The 64 kW address space is split into 8 banks of 8 kW each.
- The banking scheme allows page 0 to be swapped for other pages, although
- since page 0 has special significance, this should probably not be done
- normally. This leaves 7 banks and 56 kW available for switching.
- Decoupling
- NC
- U

## Sheet 7 of 7
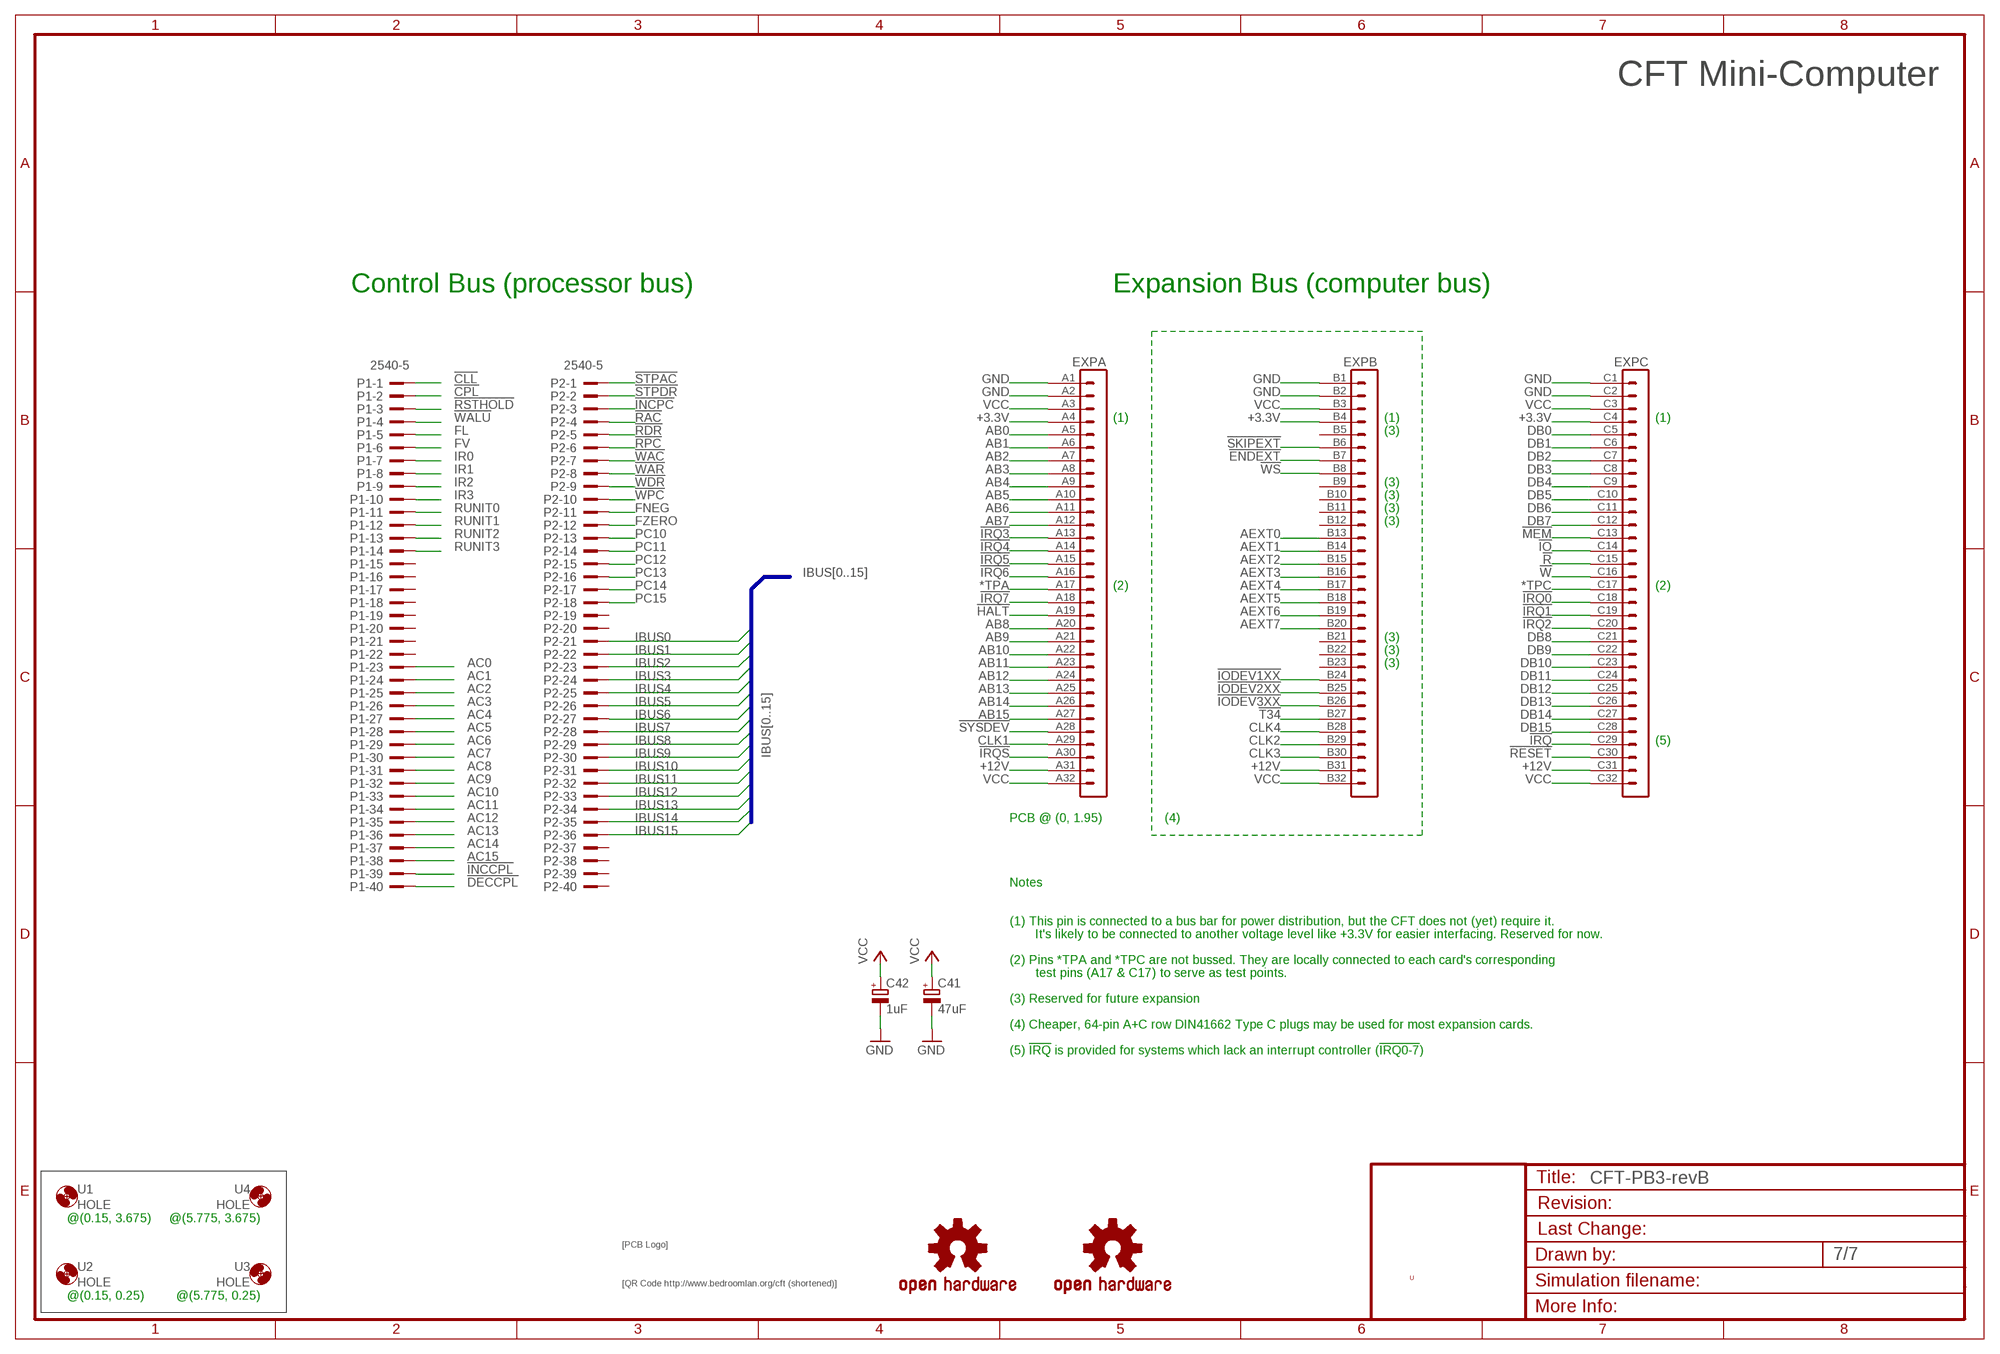
[diagram p6: schematic, sheet 7]

### Parts
$4_37_$  SIGNATURESILK  [SIGNATURE]
$4_39_$  OSHW-LOGOL  [OSHW-LOGO-L]
$4_39_$1  OSHW-LOGOL  [OSHW-LOGO-L]
$4_40_$  QRCODE-CFT  [CFT-QRCODE]
C41  47uF  CPOL-EUE2.5-5  [E2,5-5]
C42  1uF  CPOL-EUE2.5-5  [E2,5-5]
EXP  VG96-3K  [VG96K]
P1  2540-5  [PAK100/2500-5-40]
P2  2540-5  [PAK100/2500-5-40]
U1  HOLE  [STANDOFF_28_60]
U2  HOLE  [STANDOFF_28_60]
U3  HOLE  [STANDOFF_28_60]
U4  HOLE  [STANDOFF_28_60]

### Nets
!CLL: P1.1 ; also sheet 2
!CPL: P1.2 ; also sheet 2
!DECCPL: P1.40 ; also sheet 2
!ENDEXT: EXP.B7
!HALT: EXP.A19
!INCCPL: P1.39 ; also sheet 2
!INCPC: P2.3
!IO: EXP.C14
!IODEV1XX: EXP.B24
!IODEV2XX: EXP.B25
!IODEV3XX: EXP.B26
!IRQ: EXP.C29
!IRQ0: EXP.C18
!IRQ1: EXP.C19
!IRQ2: EXP.C20
!IRQ3: EXP.A13
!IRQ4: EXP.A14
!IRQ5: EXP.A15
!IRQ6: EXP.A16
!IRQ7: EXP.A18
!IRQS: EXP.A30 ; also sheet 5
!MEM: EXP.C13 ; also sheet 6
!R: EXP.C15
!RAC: P2.4
!RDR: P2.5
!RESET: EXP.C30 ; also sheet 2,3,4,5,6
!RPC: P2.6
!RSTHOLD: P1.3 ; also sheet 3
!SKIPEXT: EXP.B6
!STPAC: P2.1
!STPDR: P2.2
!SYSDEV: EXP.A28 ; also sheet 6
!T34: EXP.B27 ; also sheet 3
!W: EXP.C16 ; also sheet 6
!WAC: P2.7
!WALU: P1.4 ; also sheet 3
!WAR: P2.8
!WDR: P2.9
!WPC: P2.10
!WS: EXP.B8
*TPA: EXP.A17
*TPC: EXP.C17
+3.3V: EXP.A4 EXP.B4 EXP.C4
+12V [LED power]: EXP.A31 EXP.B31 EXP.C31
AB0: EXP.A5 ; also sheet 6
AB1: EXP.A6 ; also sheet 6
AB2: EXP.A7
AB3: EXP.A8 ; also sheet 6
AB4: EXP.A9 ; also sheet 6
AB5: EXP.A10 ; also sheet 6
AB6: EXP.A11 ; also sheet 6
AB7: EXP.A12 ; also sheet 6
AB8: EXP.A20
AB9: EXP.A21
AB10: EXP.A22
AB11: EXP.A23
AB12: EXP.A24
AB13: EXP.A25 ; also sheet 6
AB14: EXP.A26 ; also sheet 6
AB15: EXP.A27 ; also sheet 6
AC0: P1.23 ; also sheet 3
AC1: P1.24 ; also sheet 3
AC2: P1.25 ; also sheet 3
AC3: P1.26 ; also sheet 3
AC4: P1.27 ; also sheet 3
AC5: P1.28 ; also sheet 3
AC6: P1.29 ; also sheet 3
AC7: P1.30 ; also sheet 3
AC8: P1.31 ; also sheet 3
AC9: P1.32 ; also sheet 3
AC10: P1.33 ; also sheet 3
AC11: P1.34 ; also sheet 3
AC12: P1.35 ; also sheet 3
AC13: P1.36 ; also sheet 3
AC14: P1.37 ; also sheet 3
AC15: P1.38 ; also sheet 3
AEXT0: EXP.B13 ; also sheet 6
AEXT1: EXP.B14 ; also sheet 6
AEXT2: EXP.B15 ; also sheet 6
AEXT3: EXP.B16 ; also sheet 6
AEXT4: EXP.B17 ; also sheet 6
AEXT5: EXP.B18 ; also sheet 6
AEXT6: EXP.B19 ; also sheet 6
AEXT7: EXP.B20 ; also sheet 6
CLK1: EXP.A29 ; also sheet 2
CLK2: EXP.B29
CLK3: EXP.B30 ; also sheet 4
CLK4: EXP.B28 ; also sheet 3
DB0: EXP.C5 ; also sheet 6
DB1: EXP.C6 ; also sheet 6
DB2: EXP.C7 ; also sheet 6
DB3: EXP.C8 ; also sheet 6
DB4: EXP.C9 ; also sheet 6
DB5: EXP.C10 ; also sheet 6
DB6: EXP.C11 ; also sheet 6
DB7: EXP.C12 ; also sheet 6
DB8: EXP.C21 ; also sheet 6
DB9: EXP.C22
DB10: EXP.C23
DB11: EXP.C24
DB12: EXP.C25
DB13: EXP.C26
DB14: EXP.C27
DB15: EXP.C28
FL: P1.5 ; also sheet 2,4,5
FNEG: P2.11
FV: P1.6 ; also sheet 4
FZERO: P2.12
GND [low power]: C41.- C42.- EXP.A1 EXP.A2 EXP.B1 EXP.B2 EXP.C1 EXP.C2 ; also sheet 2,3,4,5,6
IBUS0: P2.21 ; also sheet 3,5
IBUS1: P2.22 ; also sheet 3,5
IBUS2: P2.23 ; also sheet 3,5
IBUS3: P2.24 ; also sheet 3,5
IBUS4: P2.25 ; also sheet 3,5
IBUS5: P2.26 ; also sheet 3,5
IBUS6: P2.27 ; also sheet 3,5
IBUS7: P2.28 ; also sheet 3,5
IBUS8: P2.29 ; also sheet 3,5
IBUS9: P2.30 ; also sheet 3,5
IBUS10: P2.31 ; also sheet 3,5
IBUS11: P2.32 ; also sheet 3,5
IBUS12: P2.33 ; also sheet 3,5
IBUS13: P2.34 ; also sheet 3,5
IBUS14: P2.35 ; also sheet 3,5
IBUS15: P2.36 ; also sheet 3,5
IR0: P1.7 ; also sheet 3
IR1: P1.8
IR2: P1.9 ; also sheet 3
IR3: P1.10
PC10: P2.13
PC11: P2.14
PC12: P2.15
PC13: P2.16
PC14: P2.17
PC15: P2.18
RUNIT0: P1.11 ; also sheet 3,4
RUNIT1: P1.12 ; also sheet 3,4
RUNIT2: P1.13 ; also sheet 3
RUNIT3: P1.14 ; also sheet 3
VCC [low power]: C41.+ C42.+ EXP.A3 EXP.A32 EXP.B3 EXP.B32 EXP.C3 EXP.C32 ; also sheet 2,3,4,5,6
Unconnected: EXP.B5 EXP.B9 EXP.B10 EXP.B11 EXP.B12 EXP.B21 EXP.B22 EXP.B23 P1.15 P1.16 P1.17 P1.18 P1.19 P1.20 P1.21 P1.22 P2.19 P2.20 P2.37 P2.38 P2.39 P2.40

### Buses
IBUS[0..15]

### Notes on the sheet
- CFT Mini-Computer
- Control Bus (processor bus) | Expansion Bus (computer bus)
- (1) | (1) | (1)
- (3)
- (3)
- (3)
- (3)
- (3)
- (2) | (2)
- (3)
- (3)
- (3)
- (5)
- PCB @ (0, 1.95) | (4)
- Notes
- (1) This pin is connected to a bus bar for power distribution, but the CFT does not (yet) require it.
- It's likely to be connected to another voltage level like +3.3V for easier interfacing. Reserved for now.
- (2) Pins *TPA and *TPC are not bussed. They are locally connected to each card's corresponding
- test pins (A17 & C17) to serve as test points.
- (3) Reserved for future expansion
- (4) Cheaper, 64-pin A+C row DIN41662 Type C plugs may be used for most expansion cards.
- (5) !IRQ! is provided for systems which lack an interrupt controller (!IRQ0-7!)
- @(0.15, 3.675) | @(5.775, 3.675)
- U
- @(0.15, 0.25) | @(5.775, 0.25)

## Power pins joined to a net without a drawn wire
GND: IC1.3(GND) IC2.7(P:GND) IC3.3(GND) IC4.7(P:GND) IC5.8(P:GND) IC6.10(GND) IC7.10(GND) IC8.10(GND) IC9.10(GND) IC10.3(GND) IC11.8(GND) IC12.8(GND) IC13.10(GND) IC14.10(GND) IC15.16(GND) IC16.16(GND) IC17.16(GND) IC18.8(GND) IC19.7(P:GND) IC20.16(GND) IC21.16(GND) IC22.16(GND) IC23.10(GND) IC24.3(GND) IC25.7(P:GND) IC26.8(GND) IC27.8(P:GND) IC28.8(GND) IC29.8(GND) IC30.8(GND) IC31.8(GND) IC32.10(GND) IC33.10(GND) IC34.10(GND)
VCC: IC1.5(VCC) IC2.14(P:VCC) IC3.5(VCC) IC4.14(P:VCC) IC5.16(P:VCC) IC6.20(VCC) IC7.20(VCC) IC8.20(VCC) IC9.20(VCC) IC10.5(VCC) IC11.16(VCC) IC12.16(VCC) IC13.20(VCC) IC14.20(VCC) IC15.32(VCC) IC16.32(VCC) IC17.32(VCC) IC18.16(VCC) IC19.14(P:VCC) IC20.32(VCC) IC21.32(VCC) IC22.32(VCC) IC23.20(VCC) IC24.5(VCC) IC25.14(P:VCC) IC26.16(VCC) IC27.16(P:VCC) IC28.16(VCC) IC29.16(VCC) IC30.16(VCC) IC31.16(VCC) IC32.20(VCC) IC33.20(VCC) IC34.20(VCC)

## Library data of the parts
$4_37_$ = alexios:SIGNATURE: Soup signature
$4_39_$ $4_39_$1 = SparkFun:OSHW-LOGO: Open Source Hardware Logo This logo indicates the piece of hardware it is found on incorporates a OSHW license and/or adheres to the definition of open source hardware found here: http://freedomdefined.org/OSHW
$4_40_$ = alexios:QRCODE-*: Various QR codes in silkscreen.
C1-C40 = rcl:C-EU: CAPACITOR, European symbol
C41 C42 = rcl:CPOL-EU: POLARIZED CAPACITOR, European symbol
EXP = alexios-19inch:VG96-3: PCB EUROCARD, 96-pin type C/ABC, 2.54 mm
IC1 IC3 IC24 = alexios:74*1G08: 2-input AND gate
IC2 = alexios:74*00: Quad 2-input NAND gate
IC4 = alexios:74*32: Quad 2-input OR gate
IC5 = alexios:74*112: Dual J-K negative edge triggered FLIP FLOP, preset and clear
IC6-IC9 = alexios:74*574: 8-bit D type FLIP FLOP bus driver
IC10 = alexios:74*1G32: 2-input OR gate
IC11 IC18 IC26 = alexios:74*253: Dual 4-to 1 line data SELECTOR/MULTIPLEXER, 3-state
IC12 = alexios:74*138: 3-line to 8-line DECODER/DEMULTIPLEXER
IC13 IC14 IC32-IC34 = alexios:74*541: Octal BUFFER and LINE DRIVER, 3-state
IC15-IC17 IC20-IC22 = alexios:29F040: 4-mbit (512x8) Flash memory in a PLCC32 package (with socket). AM29F040 is an example of this.
IC19 IC25 = alexios:74*74: Dual D type positive edge triggered FLIP FLOP, preset and clear
IC23 = alexios:74*688: 8-bit MAGNITUDE/IDENTITY COMPARATOR, totem pole
IC27 = alexios:74*139: Dual 2-line to 4-line DECODER/DEMULTIPLEXER
IC28-IC31 = alexios:74*670: 4 by 4 REGISTER FILES, 3-state
LED1 = alexios:LED: LED OSRAM: - CHIPLED LG R971, LG N971, LY N971, LG Q971, LY Q971, LO R971, LY R971 LH N974, LH R974 LS Q976, LO Q976, LY Q976 LO Q996 - Hyper CHIPLED LW Q18S LB Q993, LB Q99A, LB R99A - SideLED LS A670, LO A670, LY A670, LG A670, LP A670 LB A673, LV A673, LT A673, LW A673 LH A674 LY A675 LS A676, LA A676, LO A676, LY A676, LW A676 LS A679, LY A679, LG A679 - Hyper Micro SIDELED® LS Y876, LA Y876, LO Y876, LY Y876 LT Y87S - SmartLED LW L88C, LW L88S LB L89C, LB L89S, LG L890 LS L89K, LO L89K, LY L89K LS L896, LA L896, LO L896, LY L896 - TOPLED LS T670, LO T670, LY T670, LG T670, LP T670 LSG T670, LSP T670, LSY T670, LOP T670, LYG T670 LG T671, LOG T671, LSG T671 LB T673, LV T673, LT T673, LW T673 LH T674 LS T676, LA T676, LO T676, LY T676, LB T676, LH T676, LSB T676, LW T676 LB T67C, LV T67C, LT T67C, LS T67K, LO T67K, LY T67K, LW E67C LS E67B, LA E67B, LO E67B, LY E67B, LB E67C, LV E67C, LT E67C LW T67C LS T679, LY T679, LG T679 LS T770, LO T770, LY T770, LG T770, LP T770 LB T773, LV T773, LT T773, LW T773 LH T774 LS E675, LA E675, LY E675, LS T675 LS T776, LA T776, LO T776, LY T776, LB T776 LHGB T686 LT T68C, LB T68C - Hyper Mini TOPLED® LB M676 - Mini TOPLED Santana® LG M470 LS M47K, LO M47K, LY M47K Source: http://www.osram.convergy.de LUXEON: - LUMILED® LXK2-PW12-R00, LXK2-PW12-S00, LXK2-PW14-U00, LXK2-PW14-V00 LXK2-PM12-R00, LXK2-PM12-S00, LXK2-PM14-U00 LXK2-PE12-Q00, LXK2-PE12-R00, LXK2-PE12-S00, LXK2-PE14-T00, LXK2-PE14-U00 LXK2-PB12-K00, LXK2-PB12-L00, LXK2-PB12-M00, LXK2-PB14-N00, LXK2-PB14-P00, LXK2-PB14-Q00 LXK2-PR12-L00, LXK2-PR12-M00, LXK2-PR14-Q00, LXK2-PR14-R00 LXK2-PD12-Q00, LXK2-PD12-R00, LXK2-PD12-S00 LXK2-PH12-R00, LXK2-PH12-S00 LXK2-PL12-P00, LXK2-PL12-Q00, LXK2-PL12-R00 Source: www.luxeon.com KINGBRIGHT: KA-3528ASYC Source: www.kingbright.com
P1 P2 = con-3m:2540-: 3M (TM) Pak 100 4-Wall Header Source: 3M; OC_FARNELL: 9838414; OC_NEWARK: unknown
P3 = con-panduit:057-020-: CONNECTOR 20-pin series 057 contact pc board low profile headers; OC_FARNELL: unknown; OC_NEWARK: unknown
R1-R10 = resistor:R-EU_: RESISTOR, European symbol
U1-U4 = alexios:HOLE: Hole for a standoff or mount. Hole diameter: 3.3mm. External Diameter: 6mm. Suitable for M3 standoffs.

## Net classes
0 default: width 0.152 mm, clearance 0.152 mm
1 low power: width 0.152 mm, clearance 0.152 mm
2 LED power: width 0.152 mm, clearance 0.152 mm